# Altium project Jumperless_breadboard_REV1.PrjPcb (part 3 of 4)

## Sheet WS2812B_ARRAY.SchDoc
size 1524 x 1143 mm; SheetNumber: 8; SheetTotal: 14
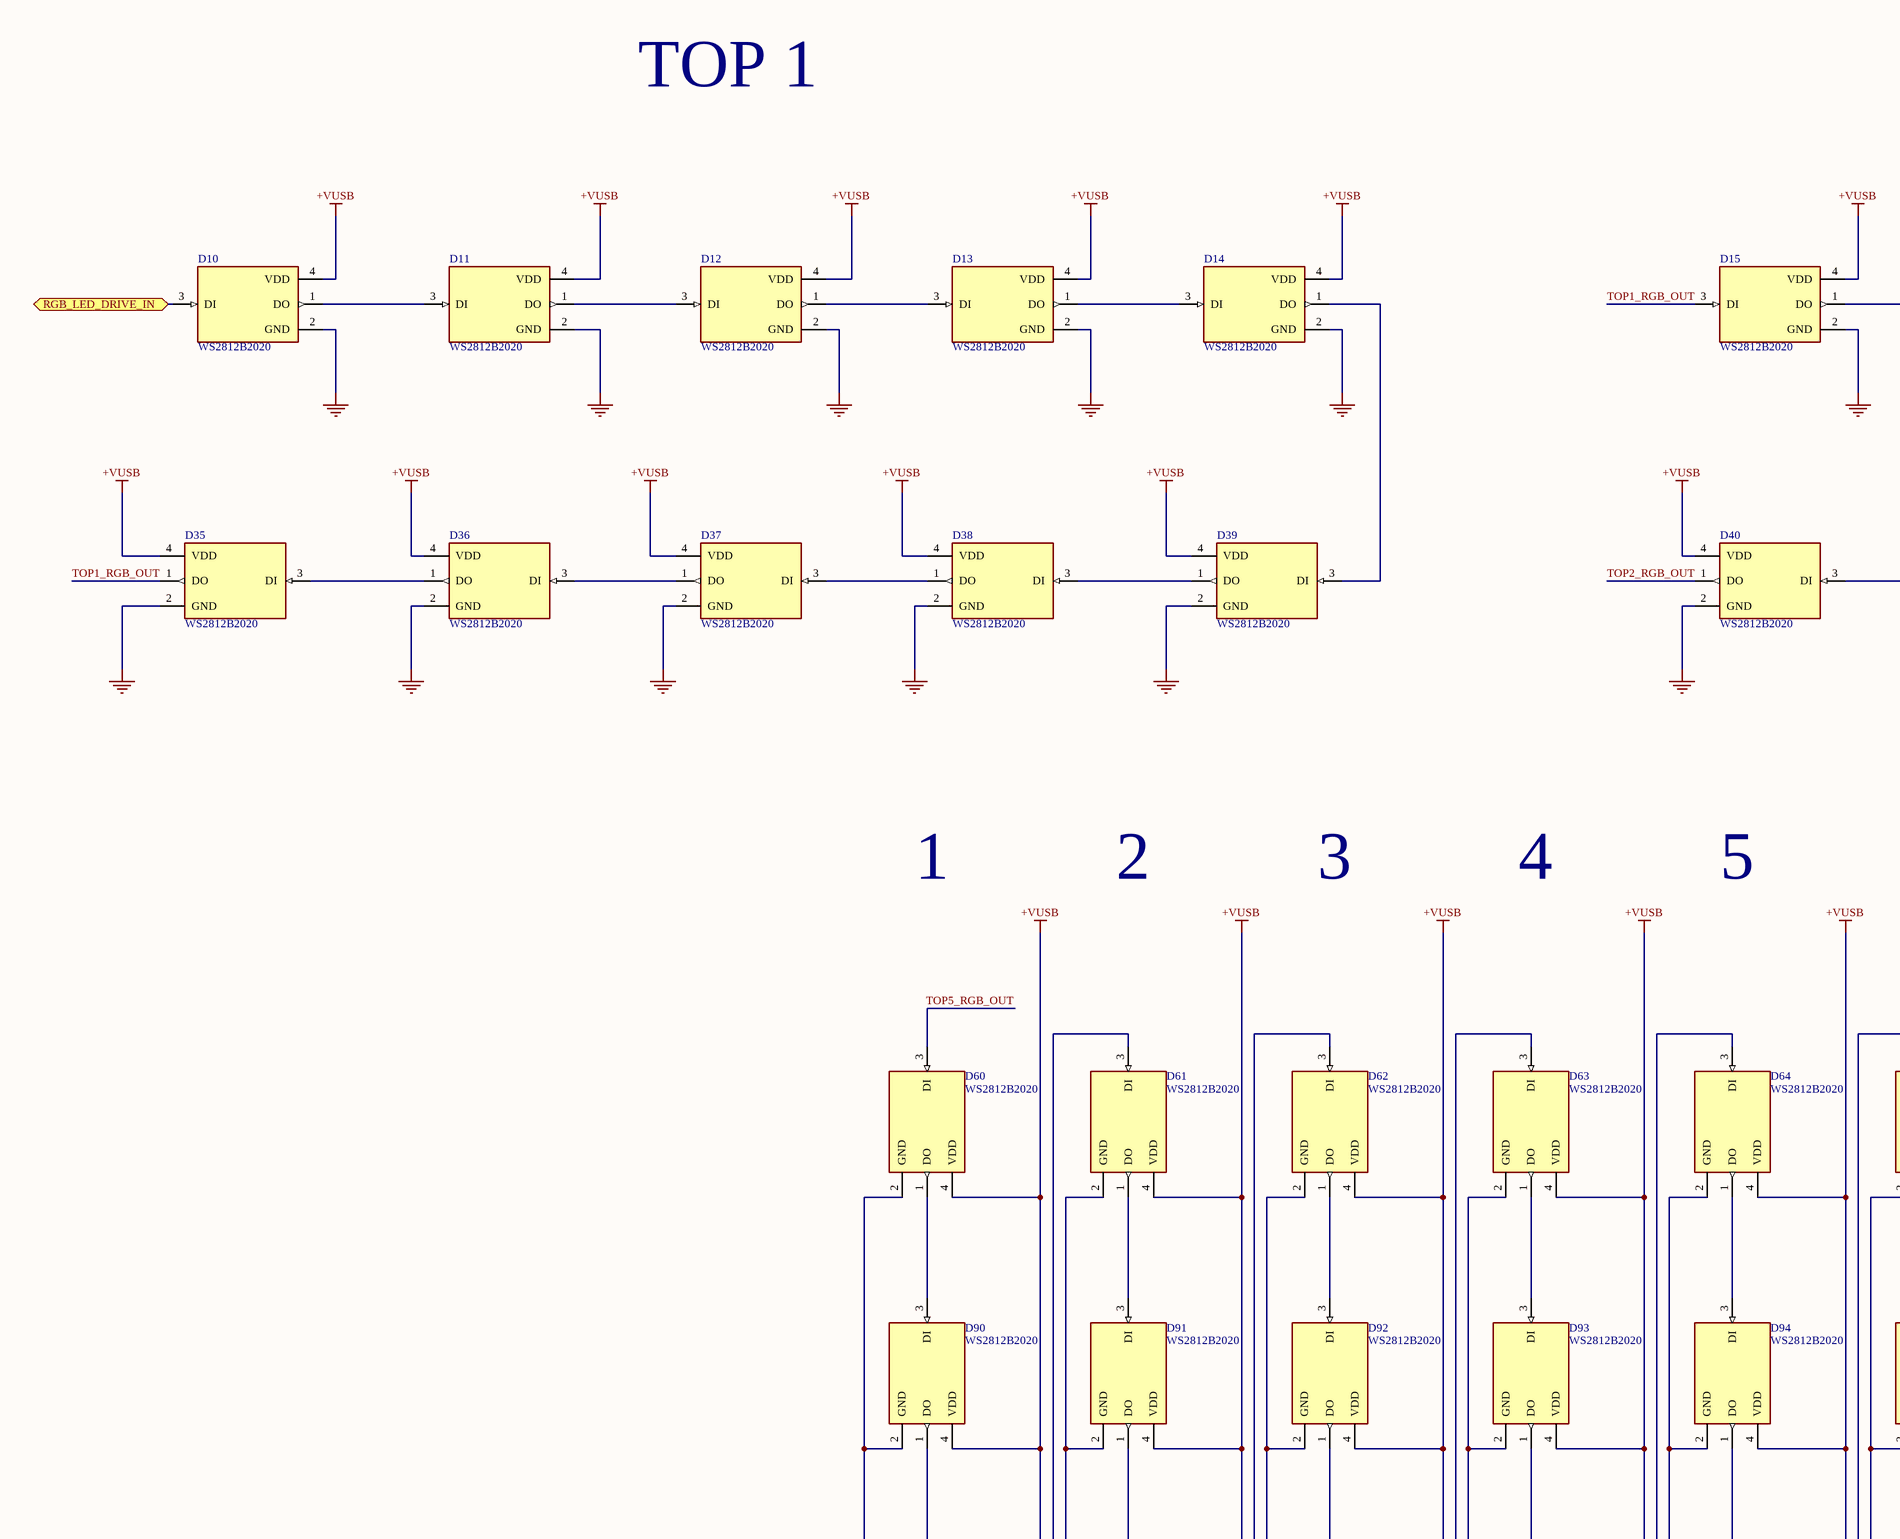
[diagram p16: WS2812B_ARRAY.SchDoc, top column 1 of 4]
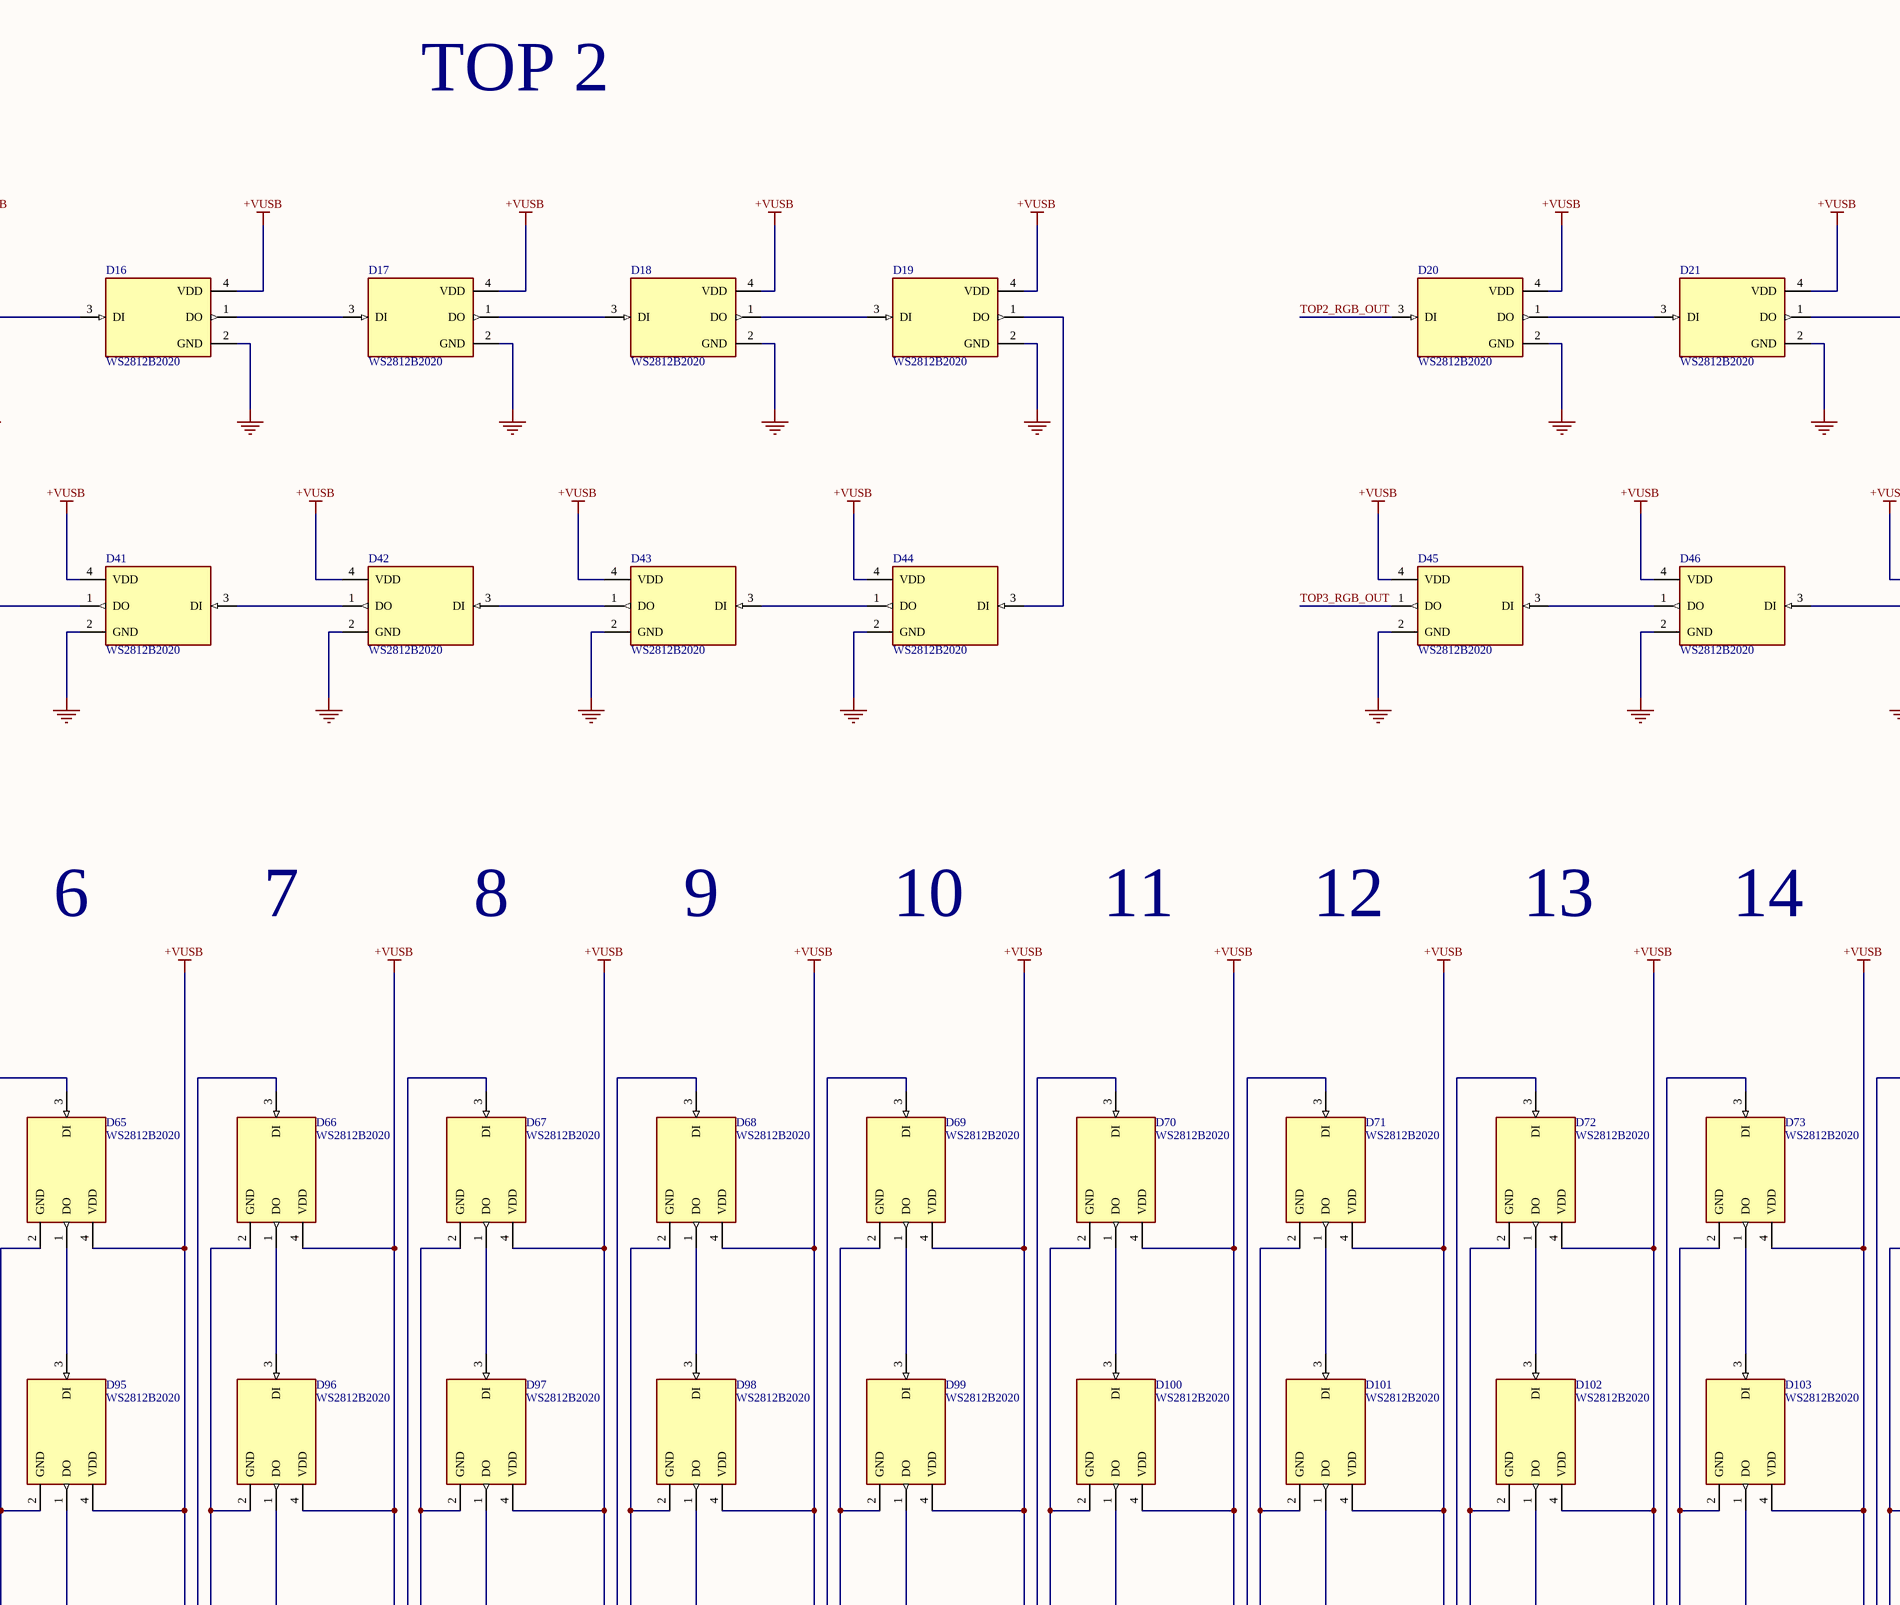
[diagram p17: WS2812B_ARRAY.SchDoc, top column 2 of 4]
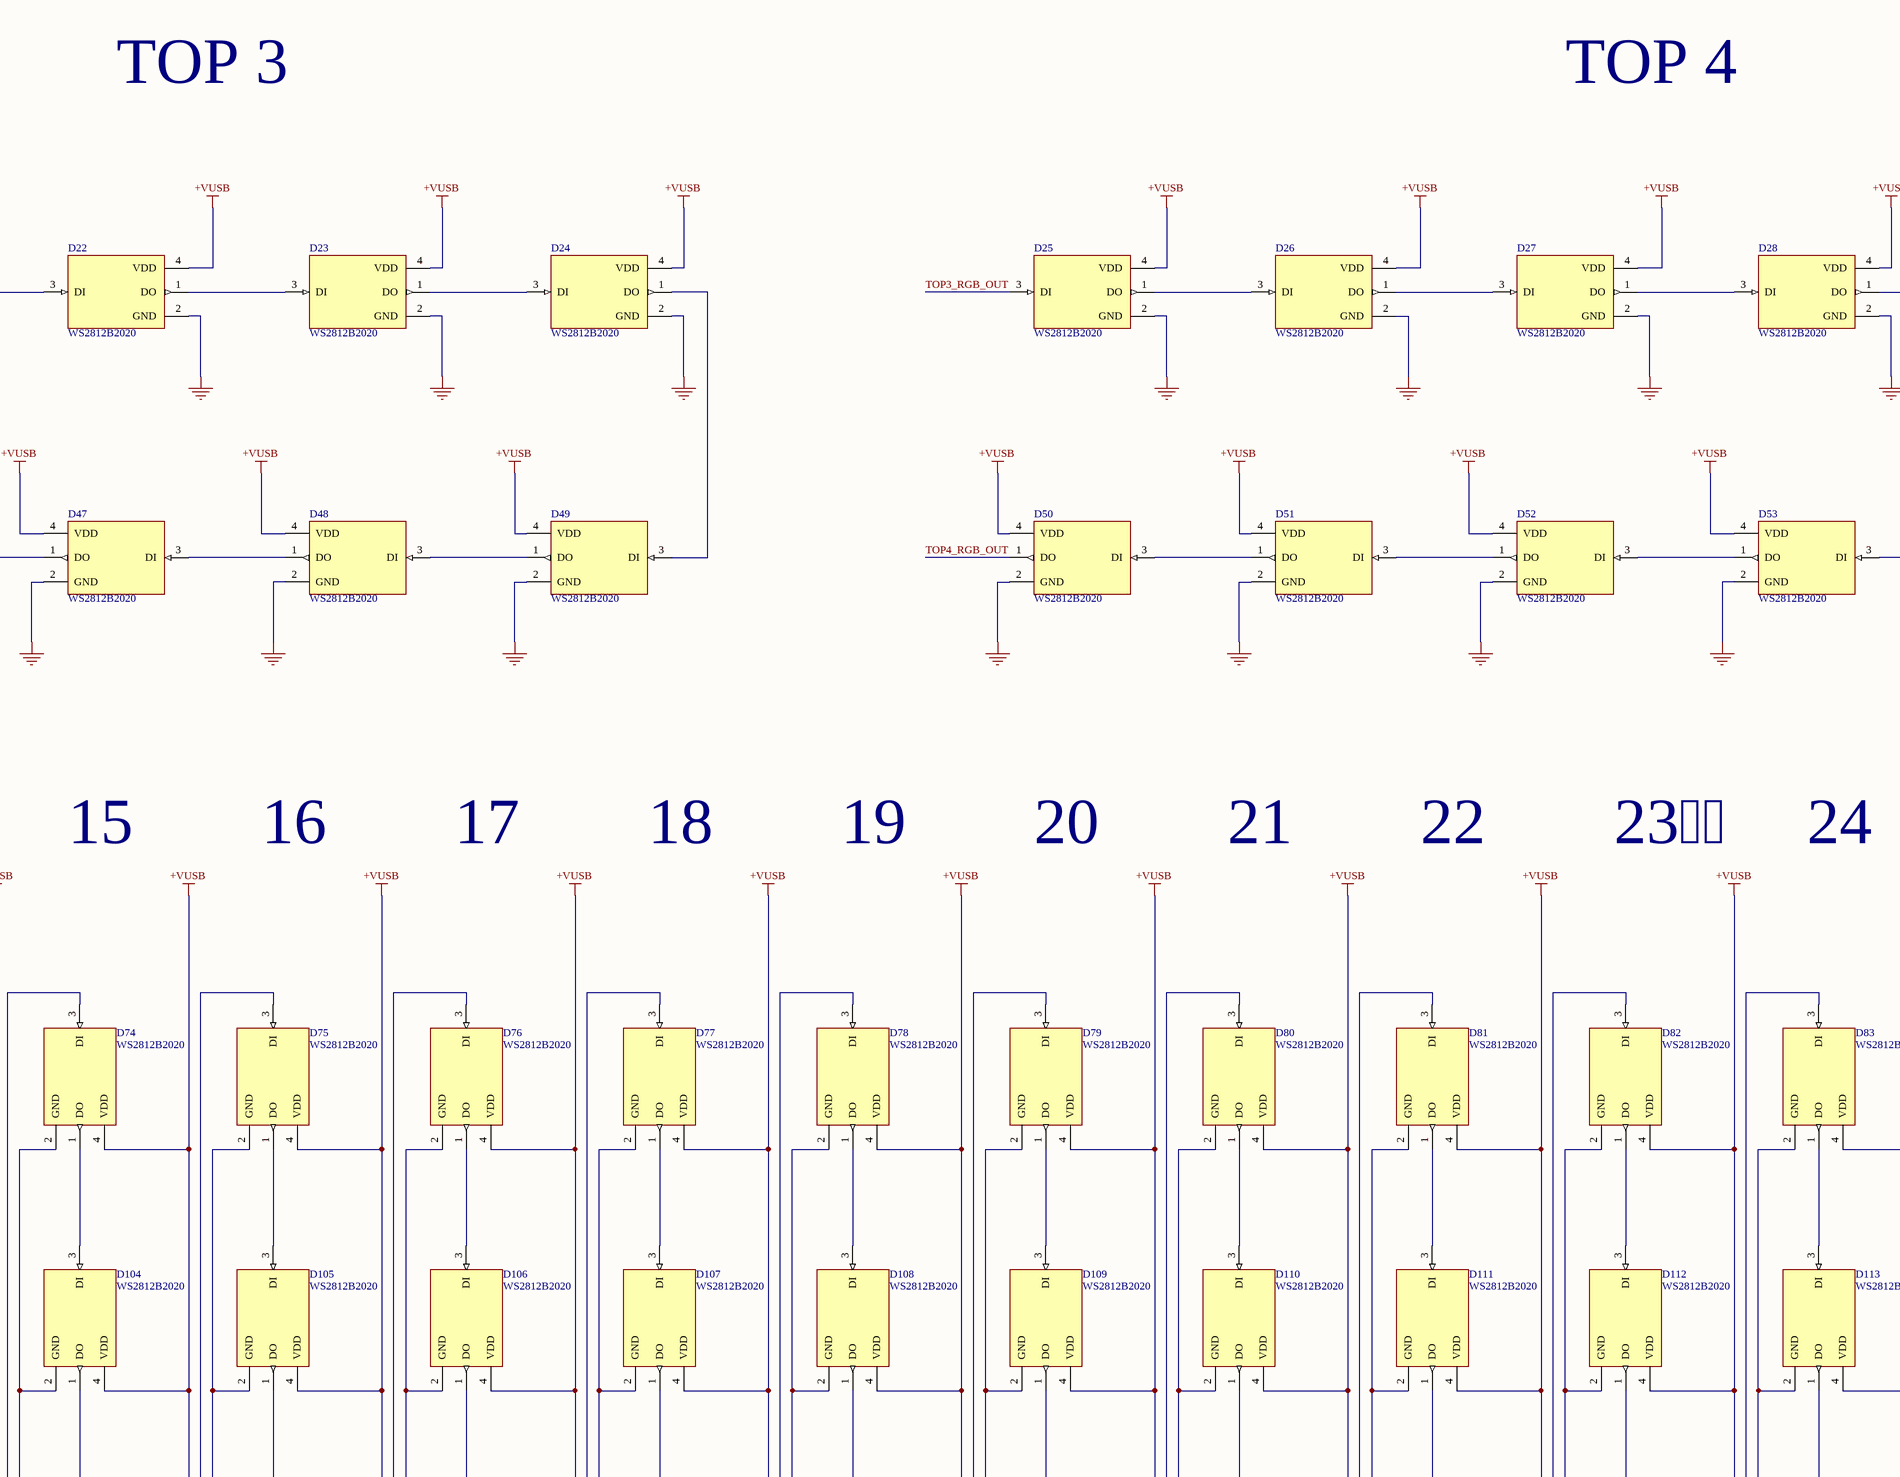
[diagram p18: WS2812B_ARRAY.SchDoc, top column 3 of 4]
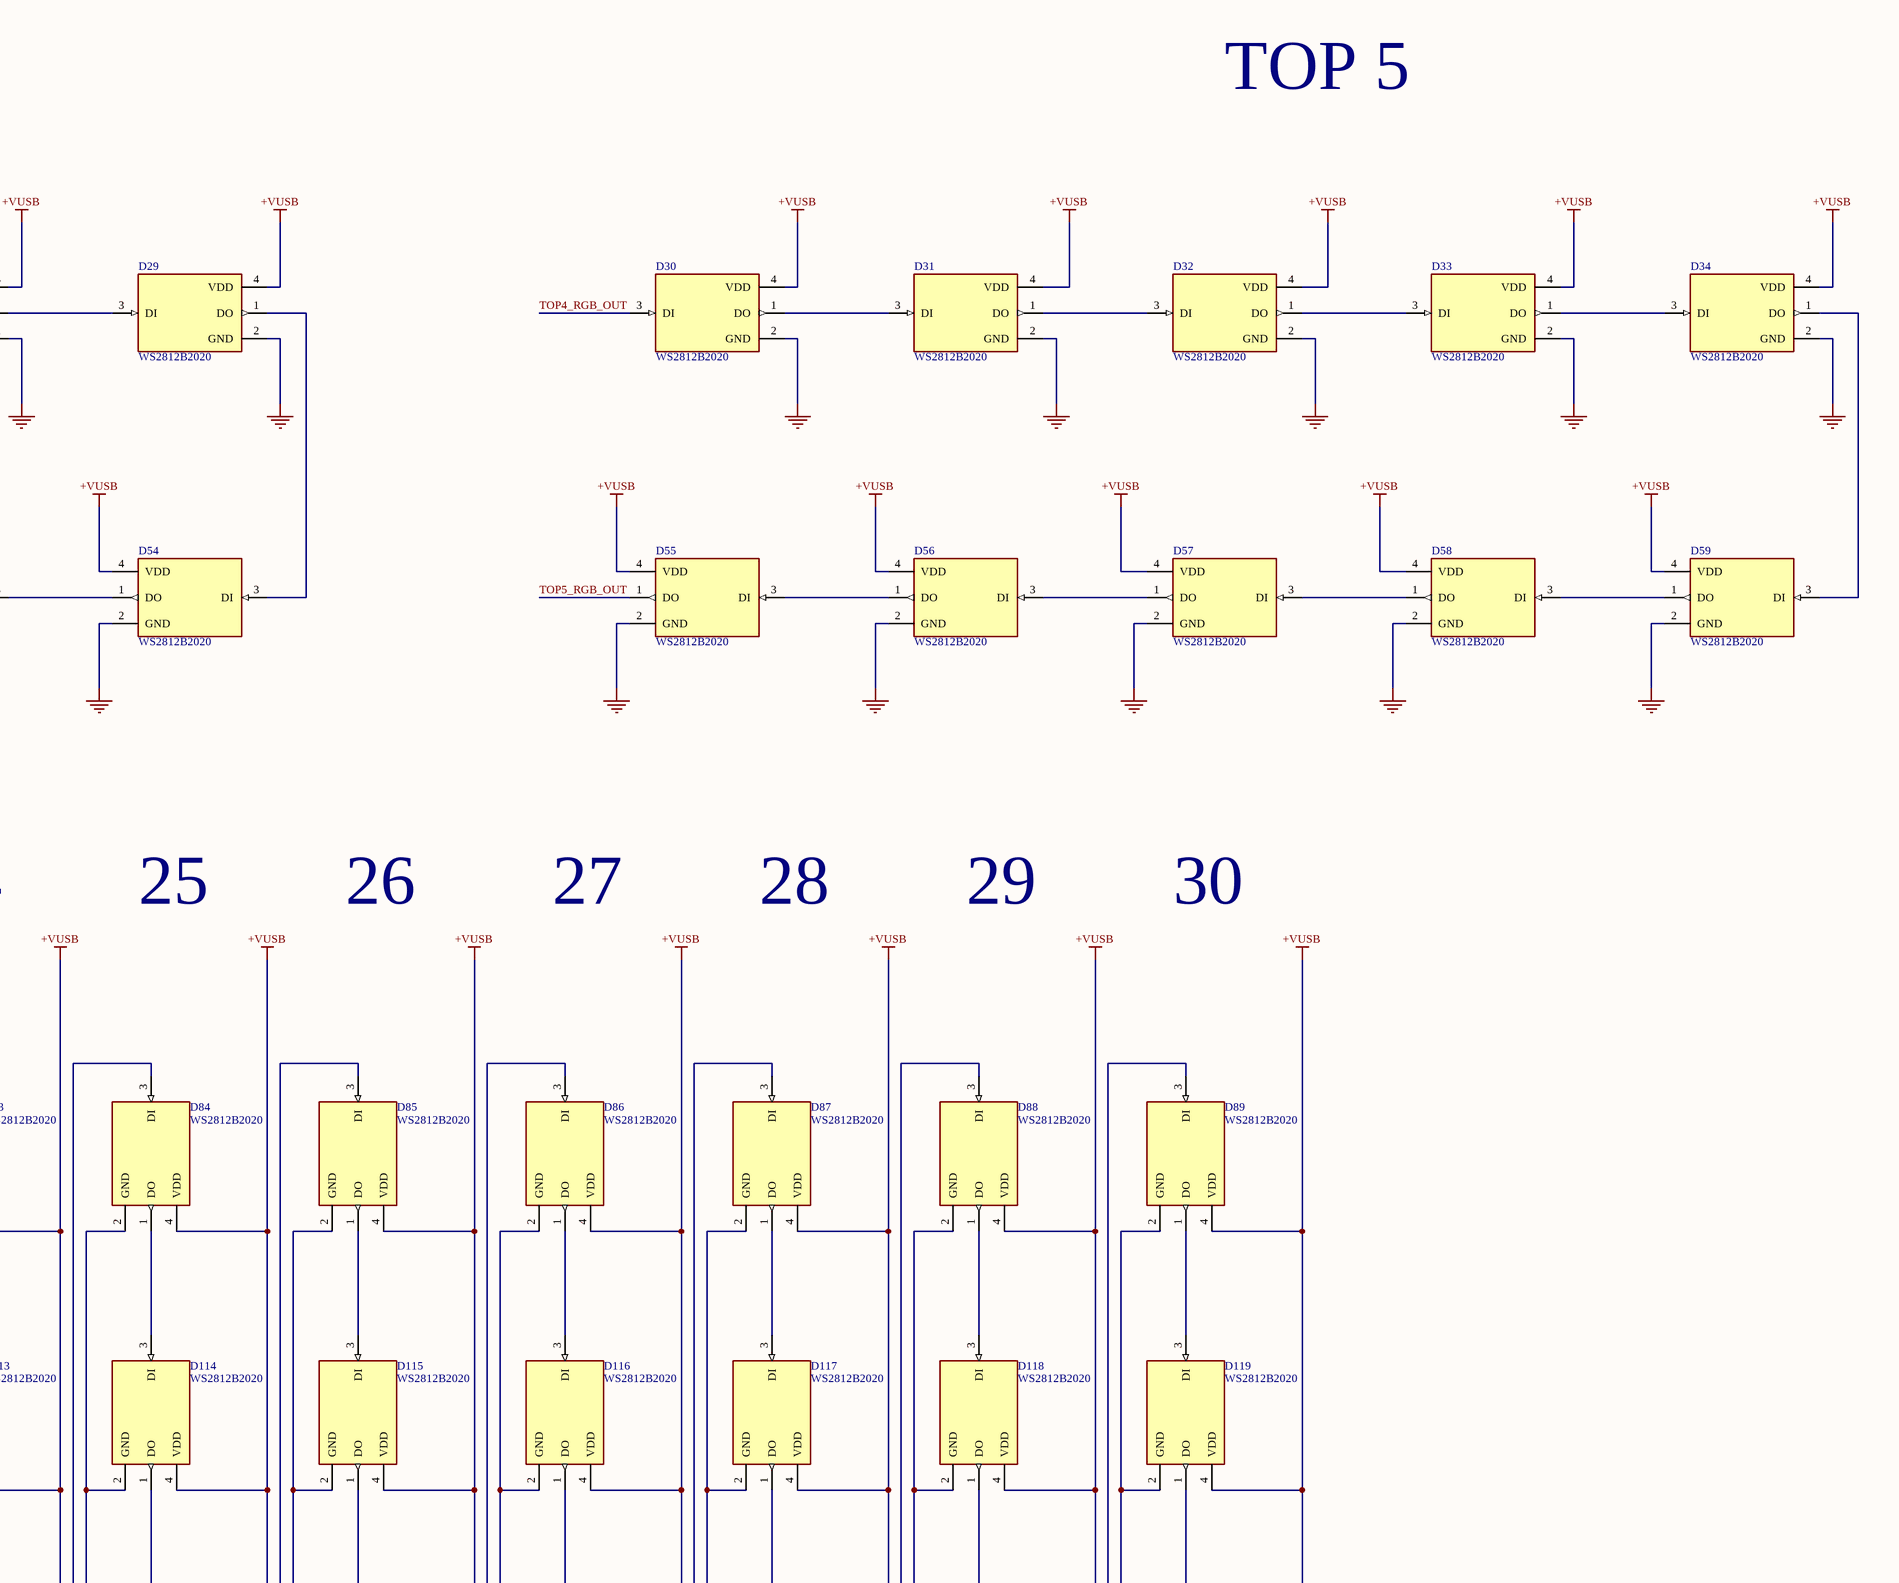
[diagram p19: WS2812B_ARRAY.SchDoc, top column 4 of 4]
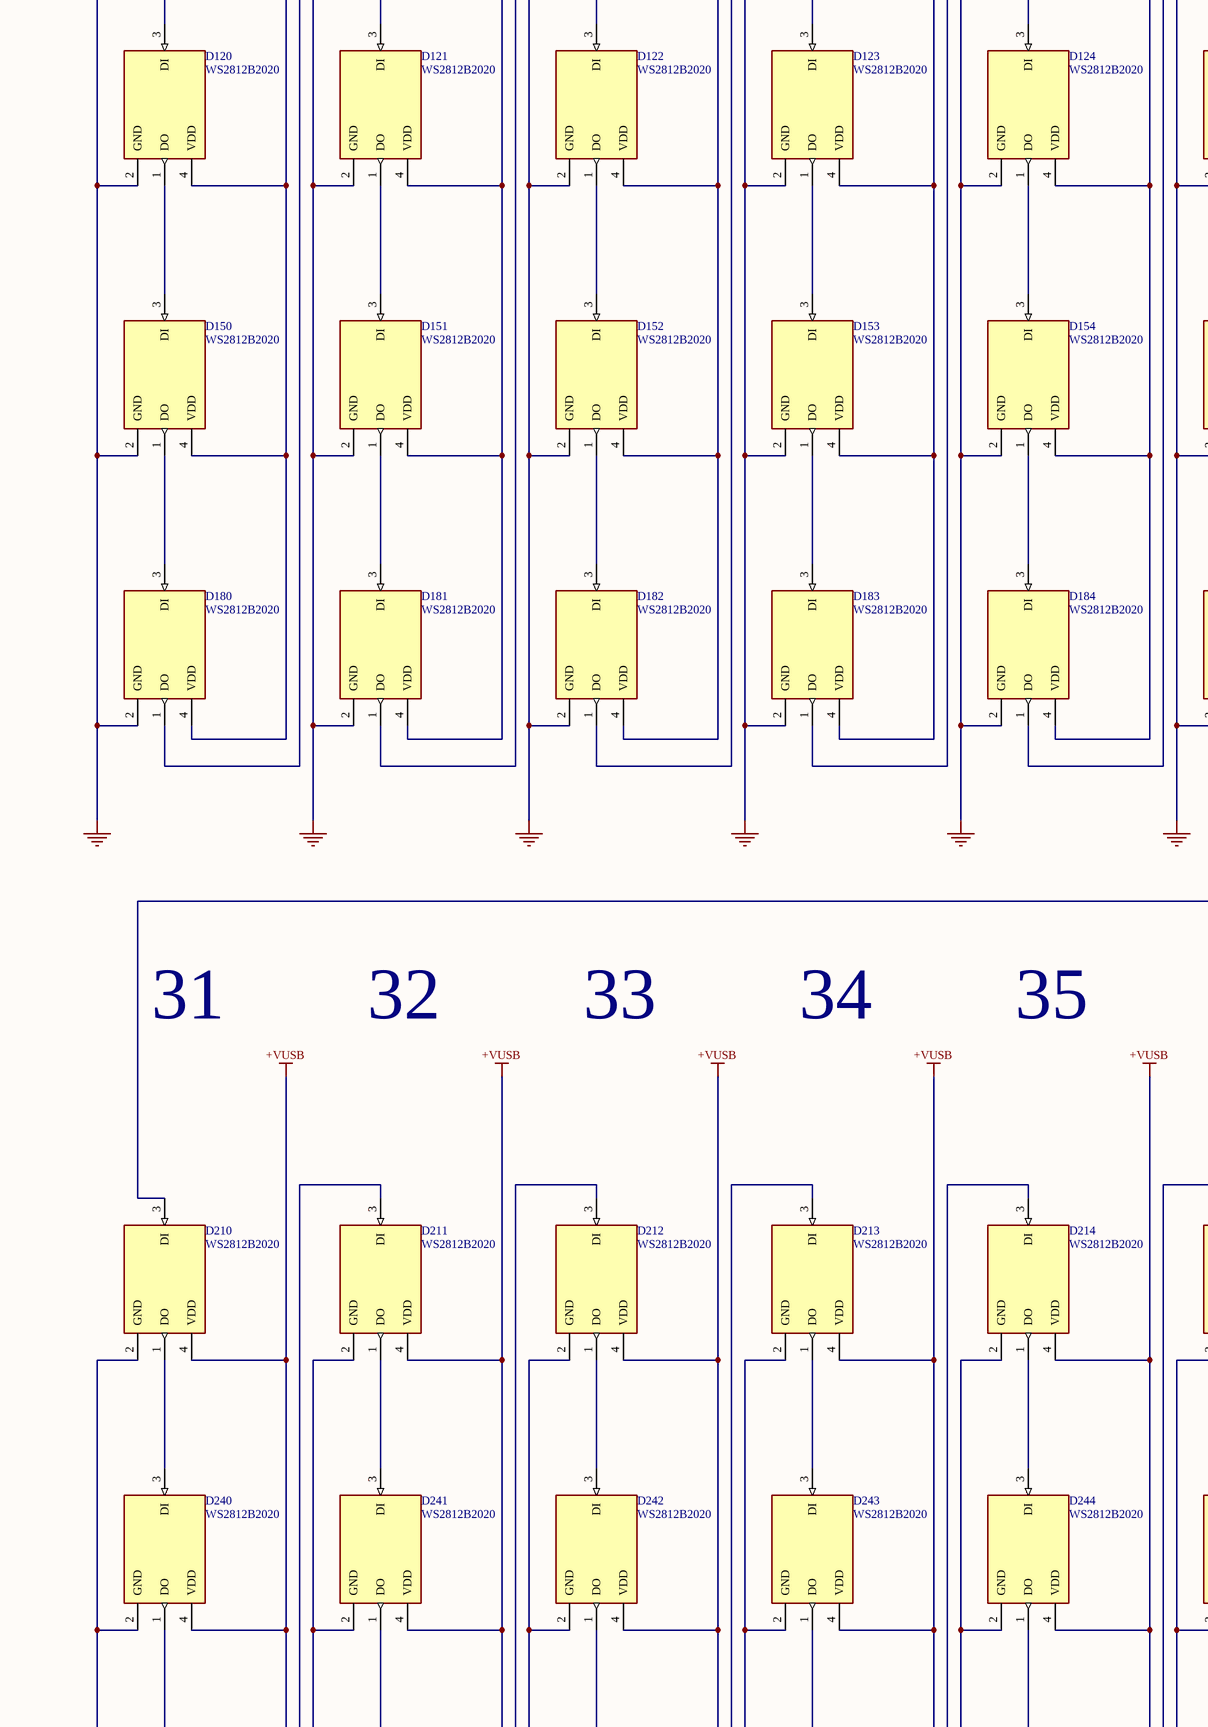
[diagram p20: WS2812B_ARRAY.SchDoc, centre column 1 of 4]
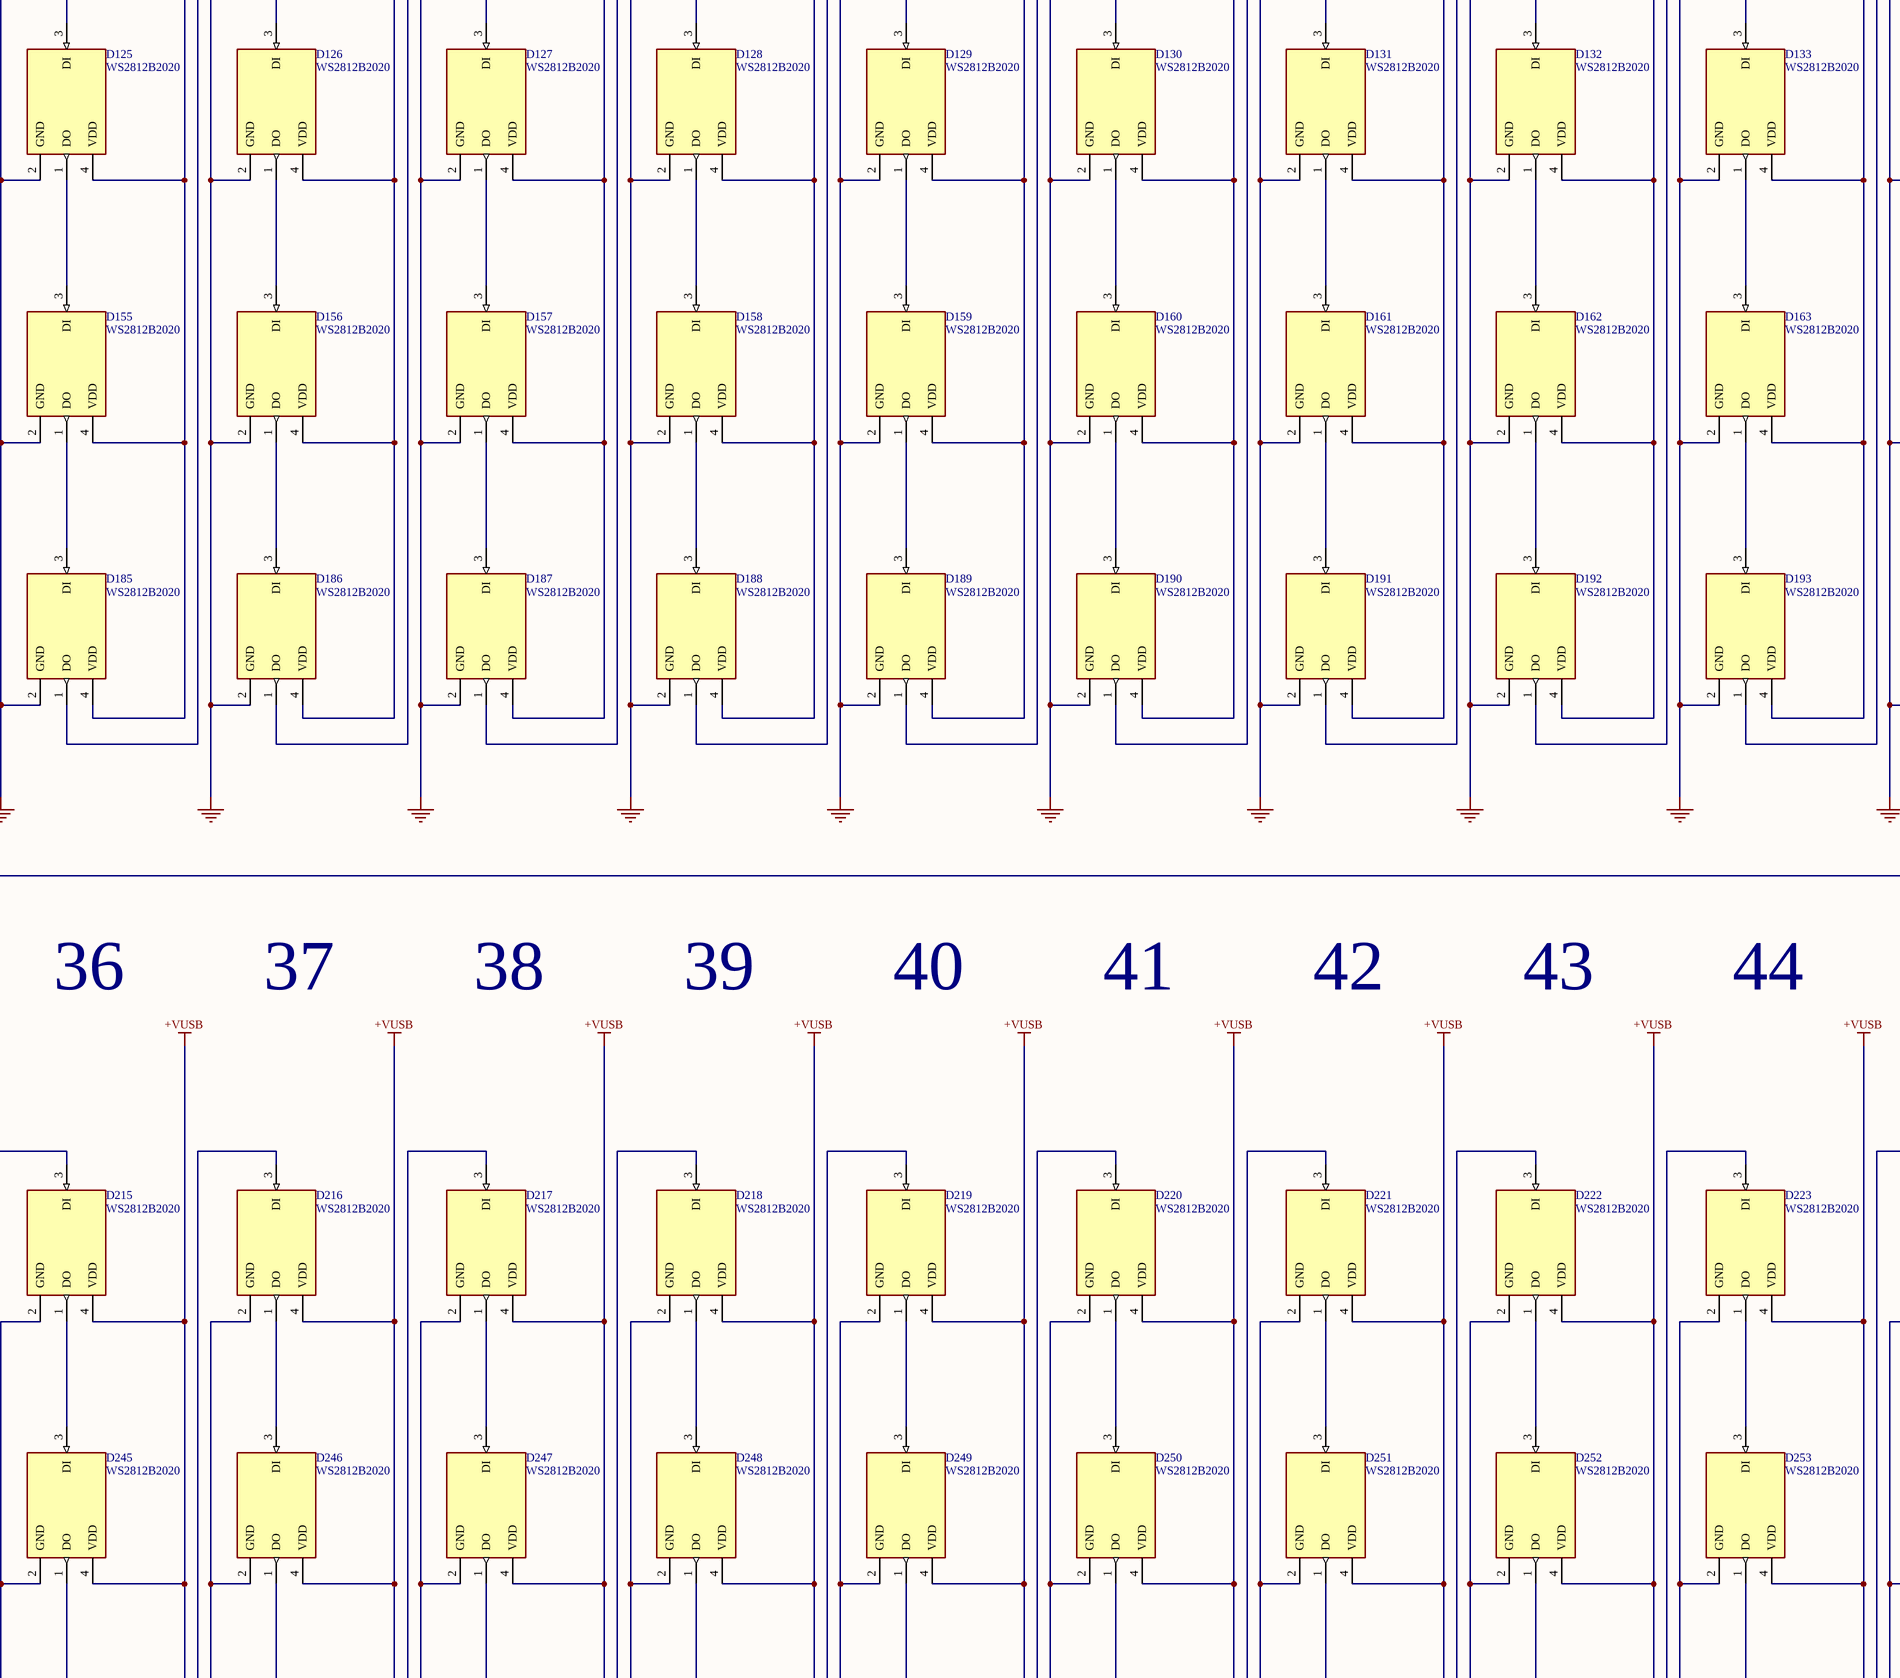
[diagram p21: WS2812B_ARRAY.SchDoc, centre column 2 of 4]
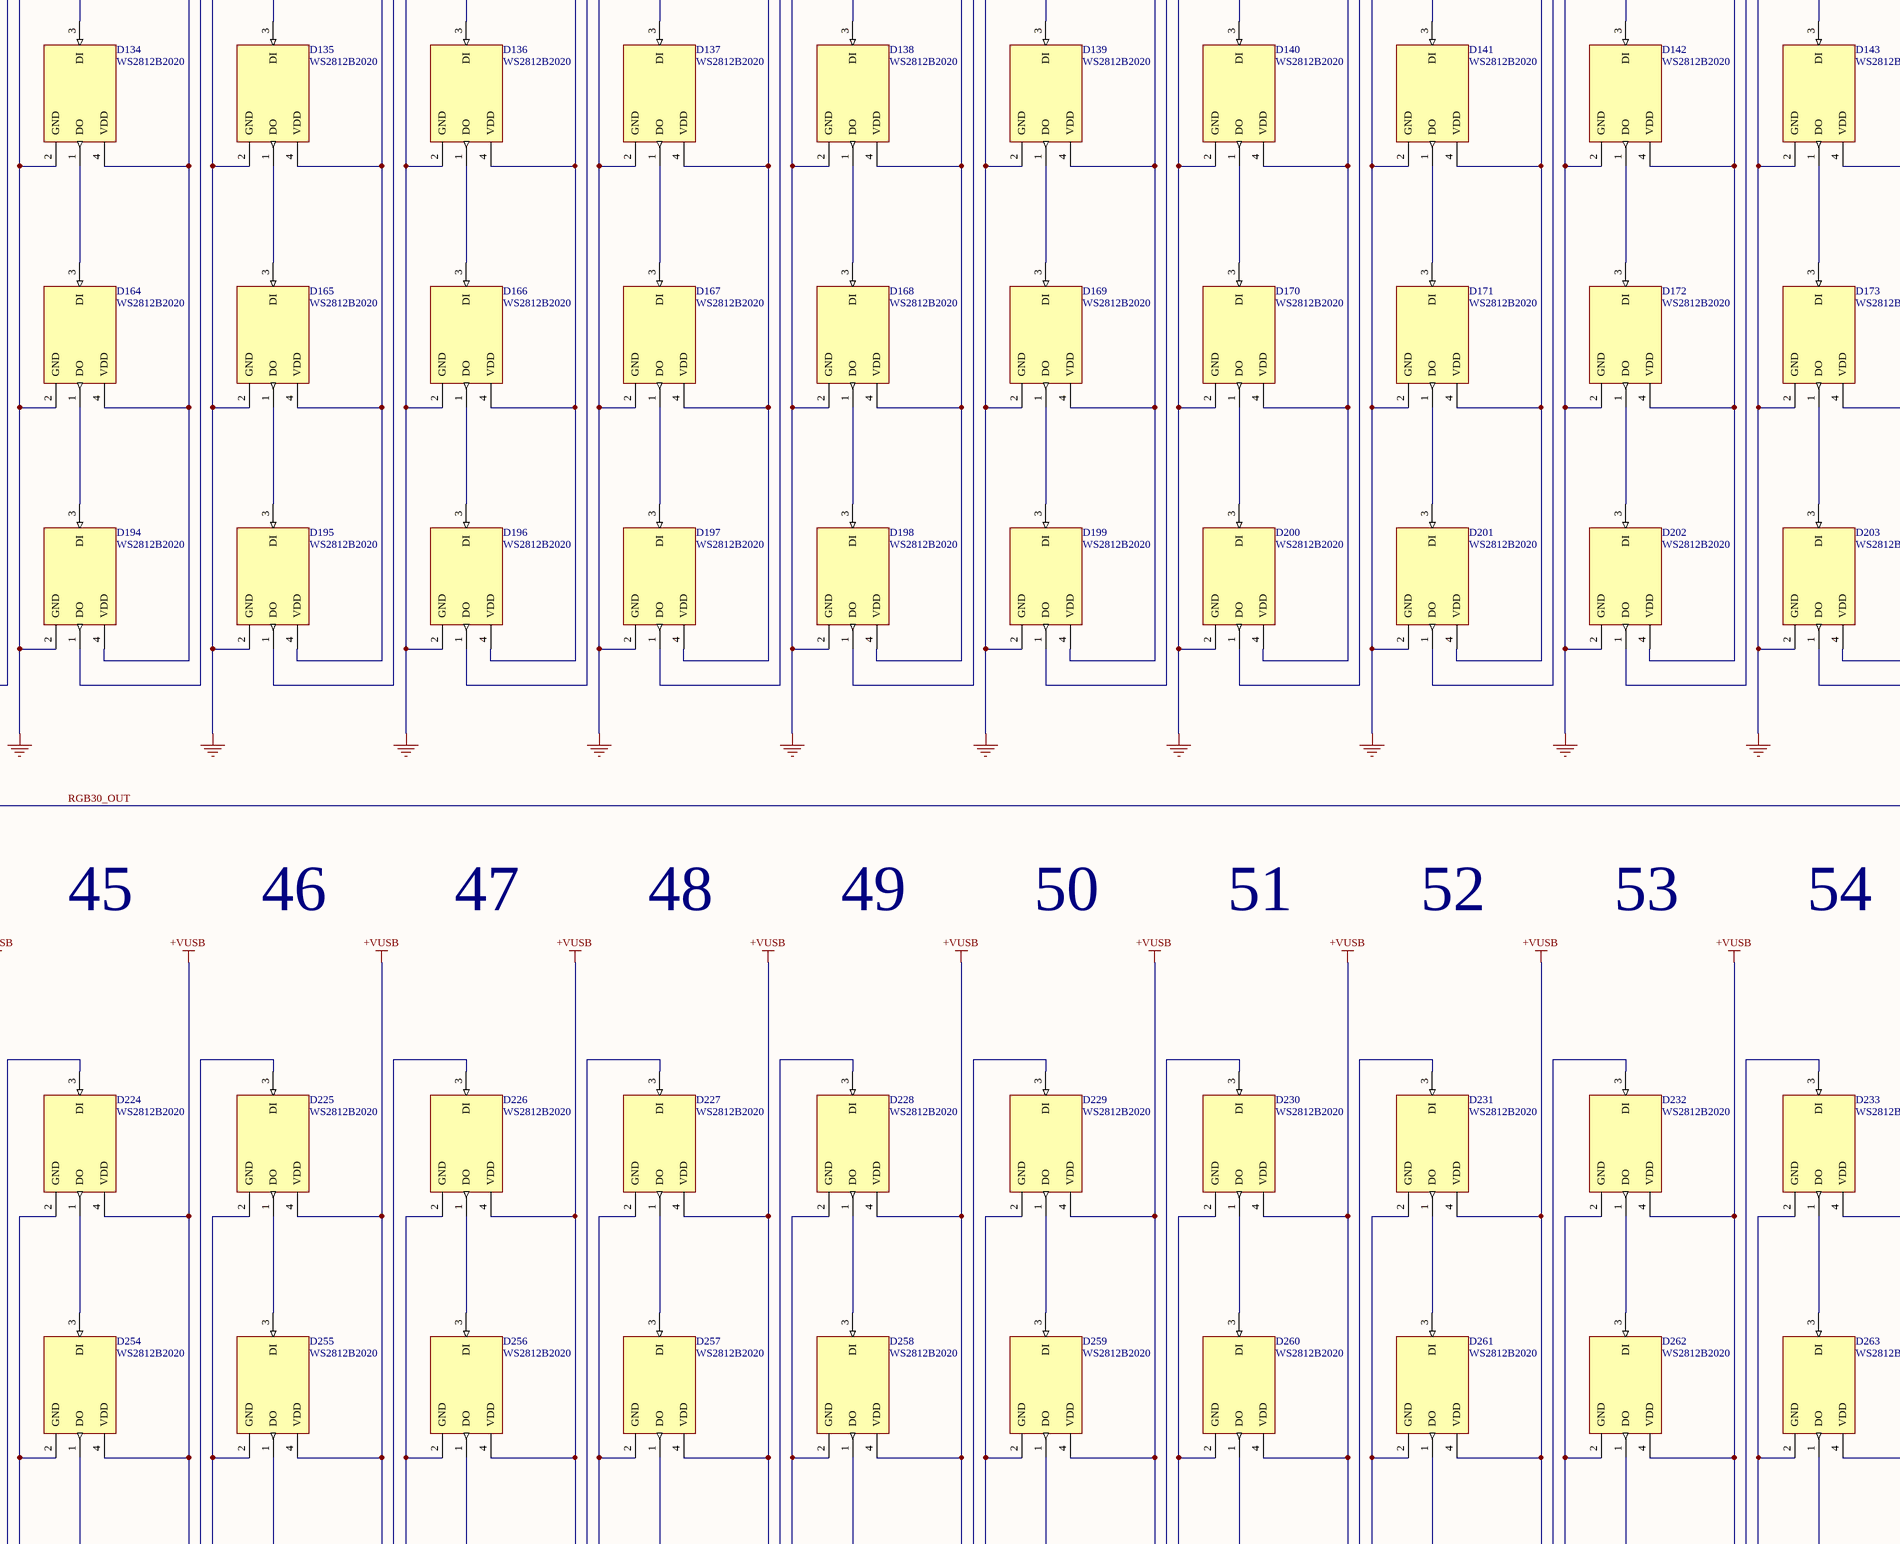
[diagram p22: WS2812B_ARRAY.SchDoc, centre column 3 of 4]
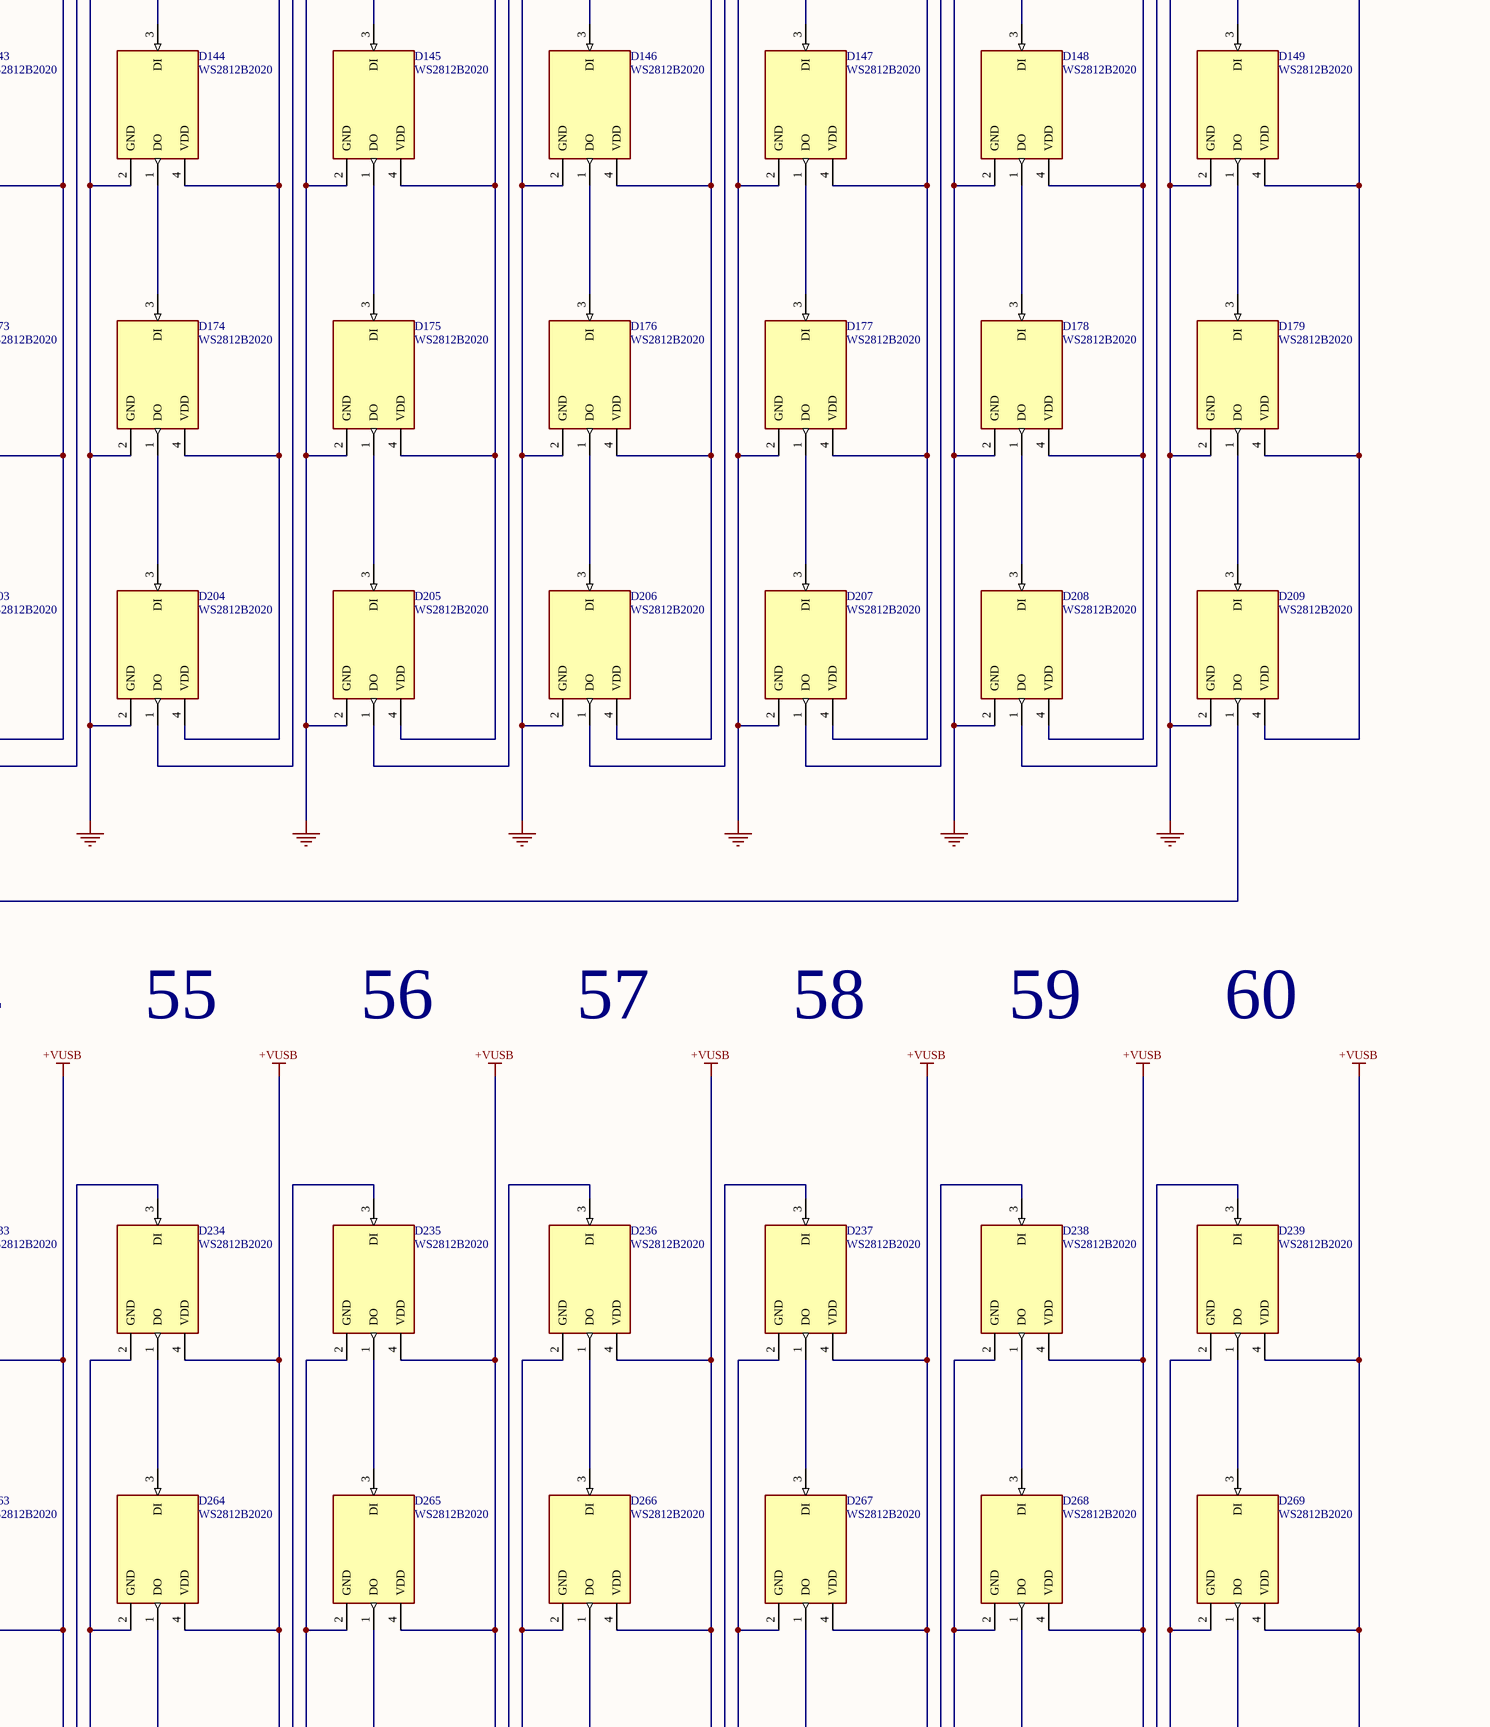
[diagram p23: WS2812B_ARRAY.SchDoc, centre column 4 of 4]
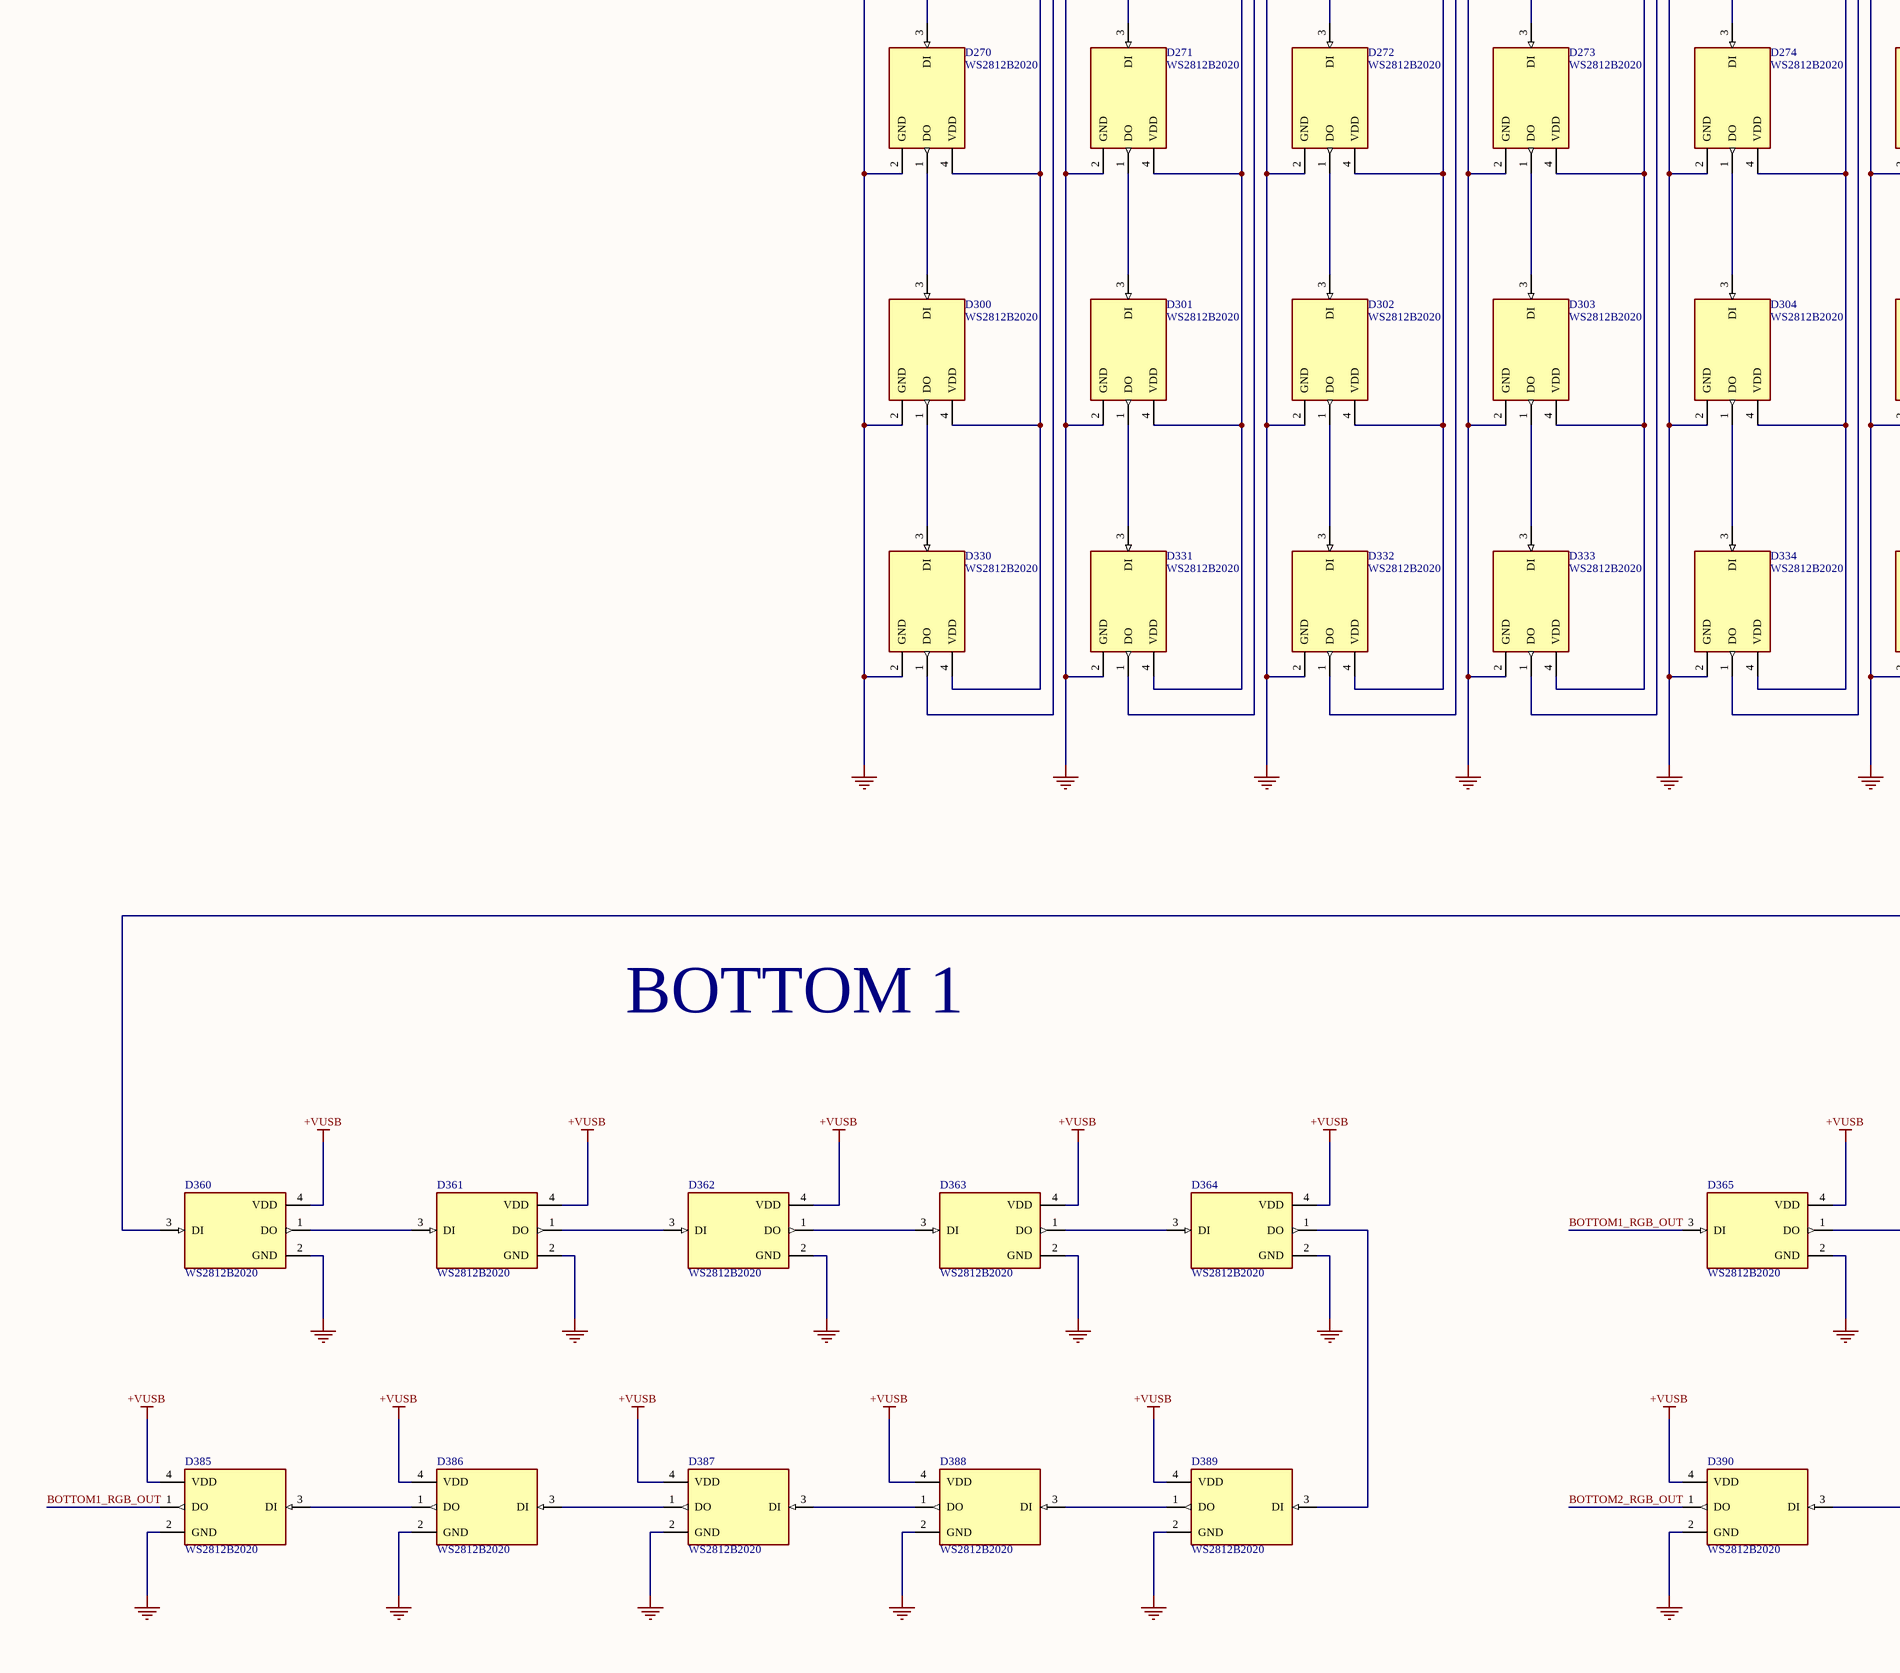
[diagram p24: WS2812B_ARRAY.SchDoc, bottom column 1 of 4]
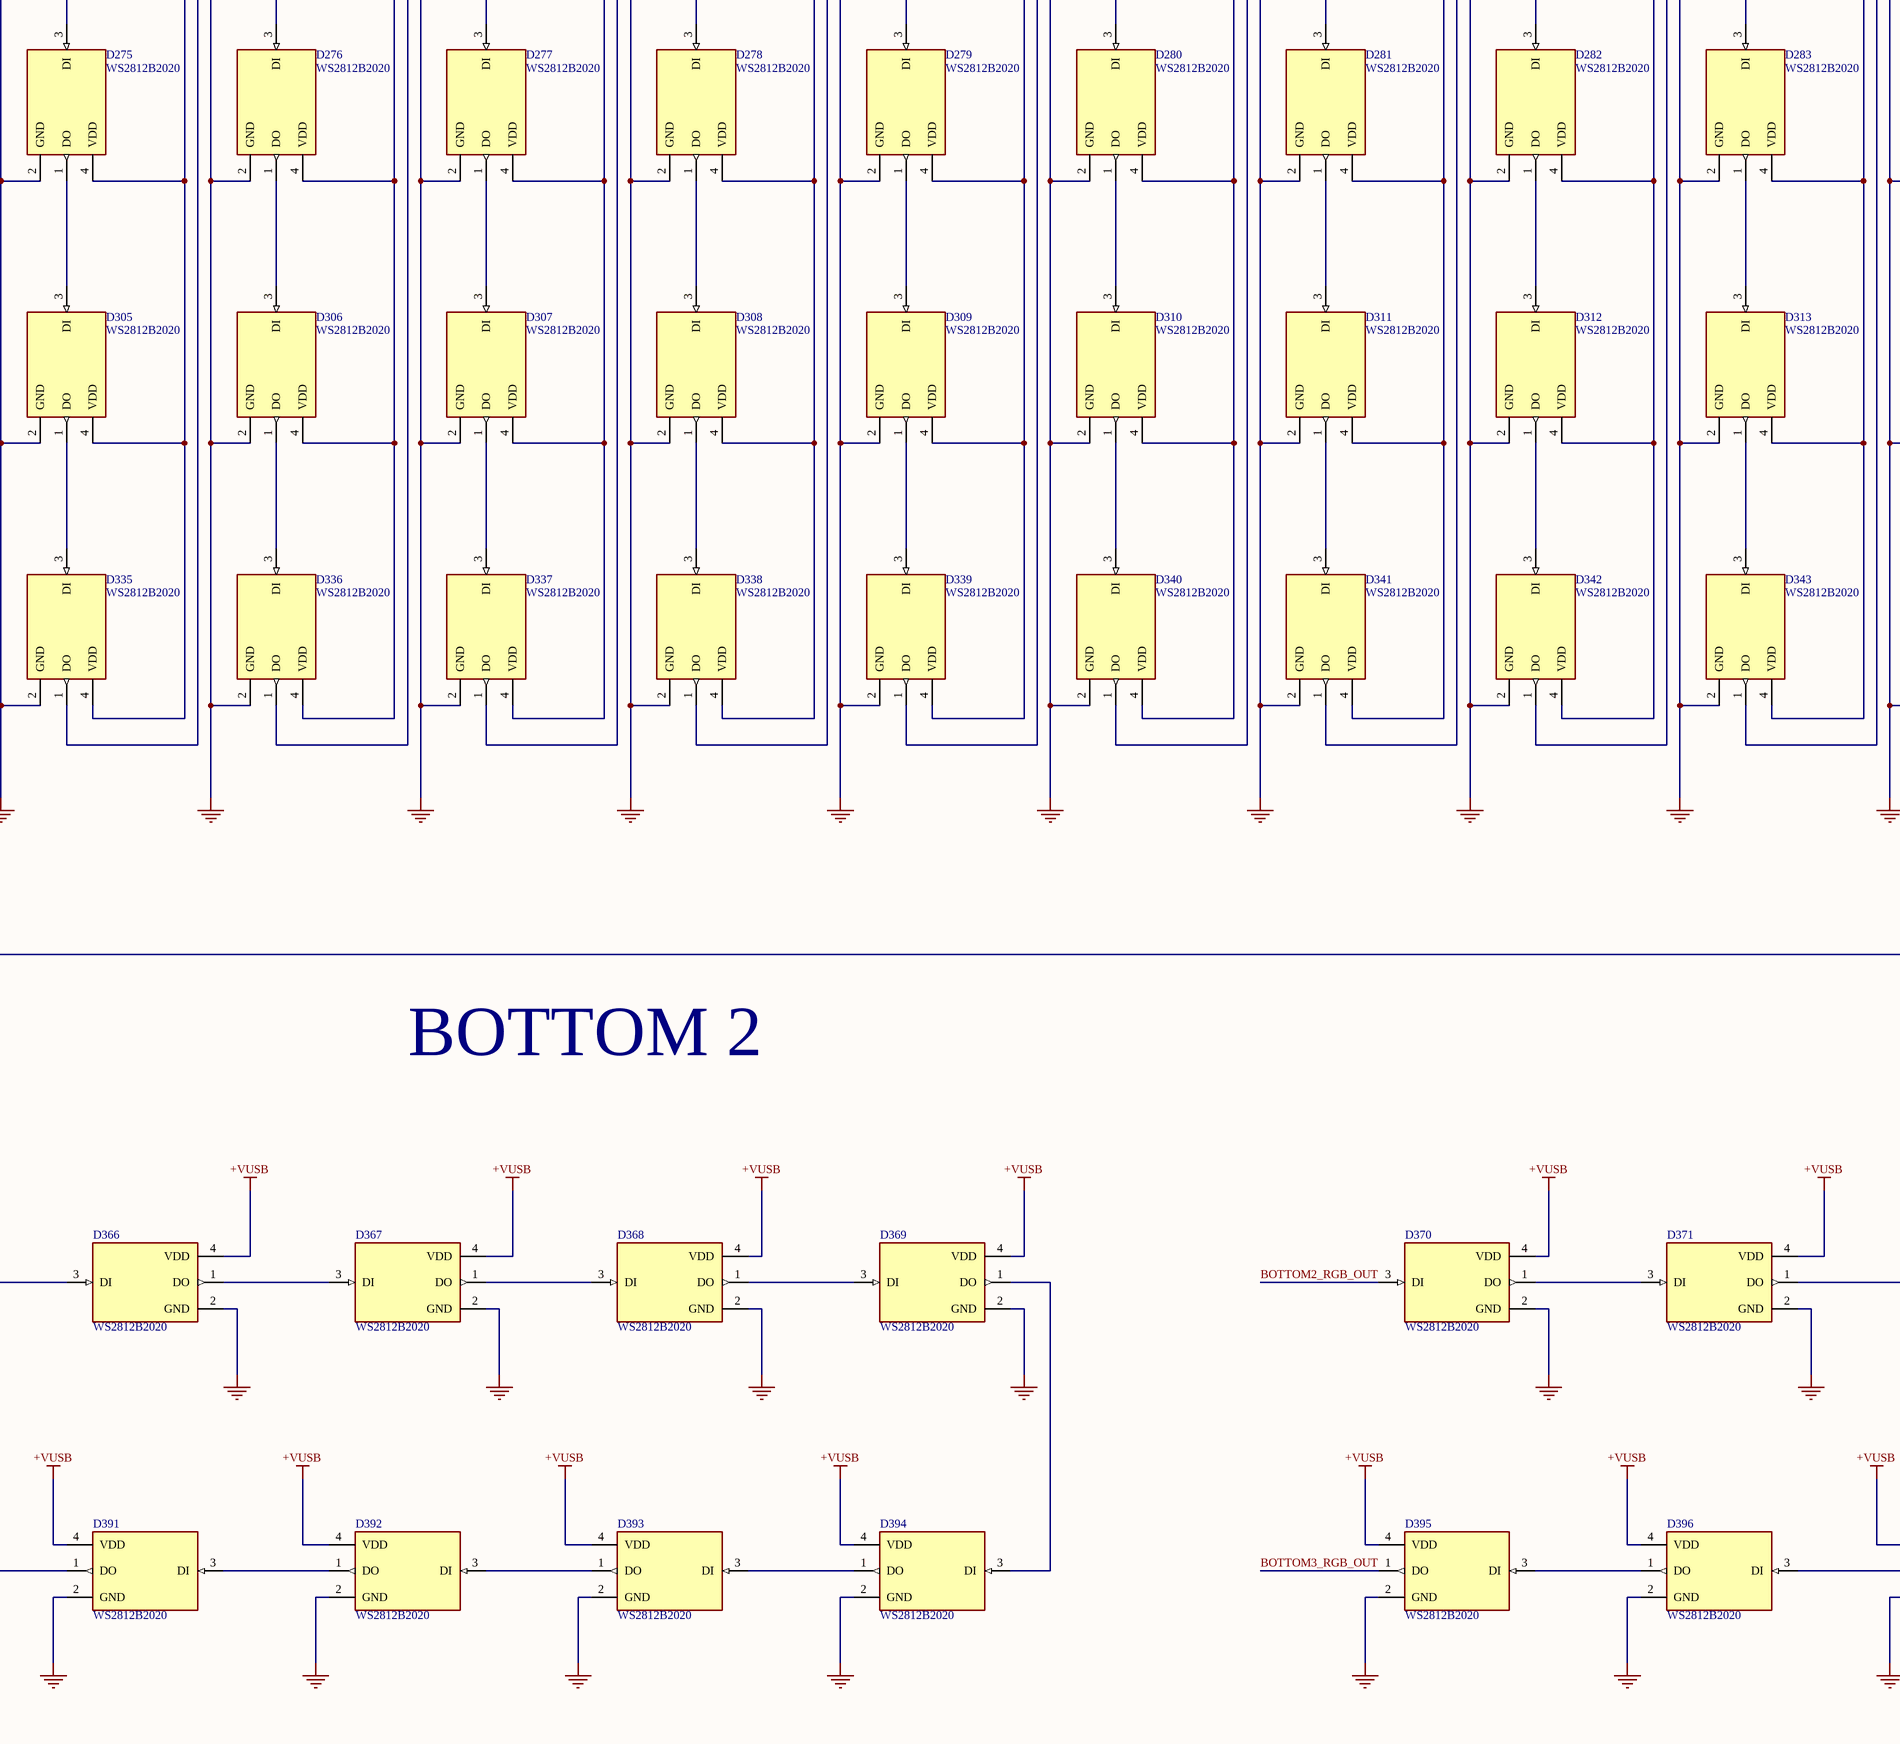
[diagram p25: WS2812B_ARRAY.SchDoc, bottom column 2 of 4]
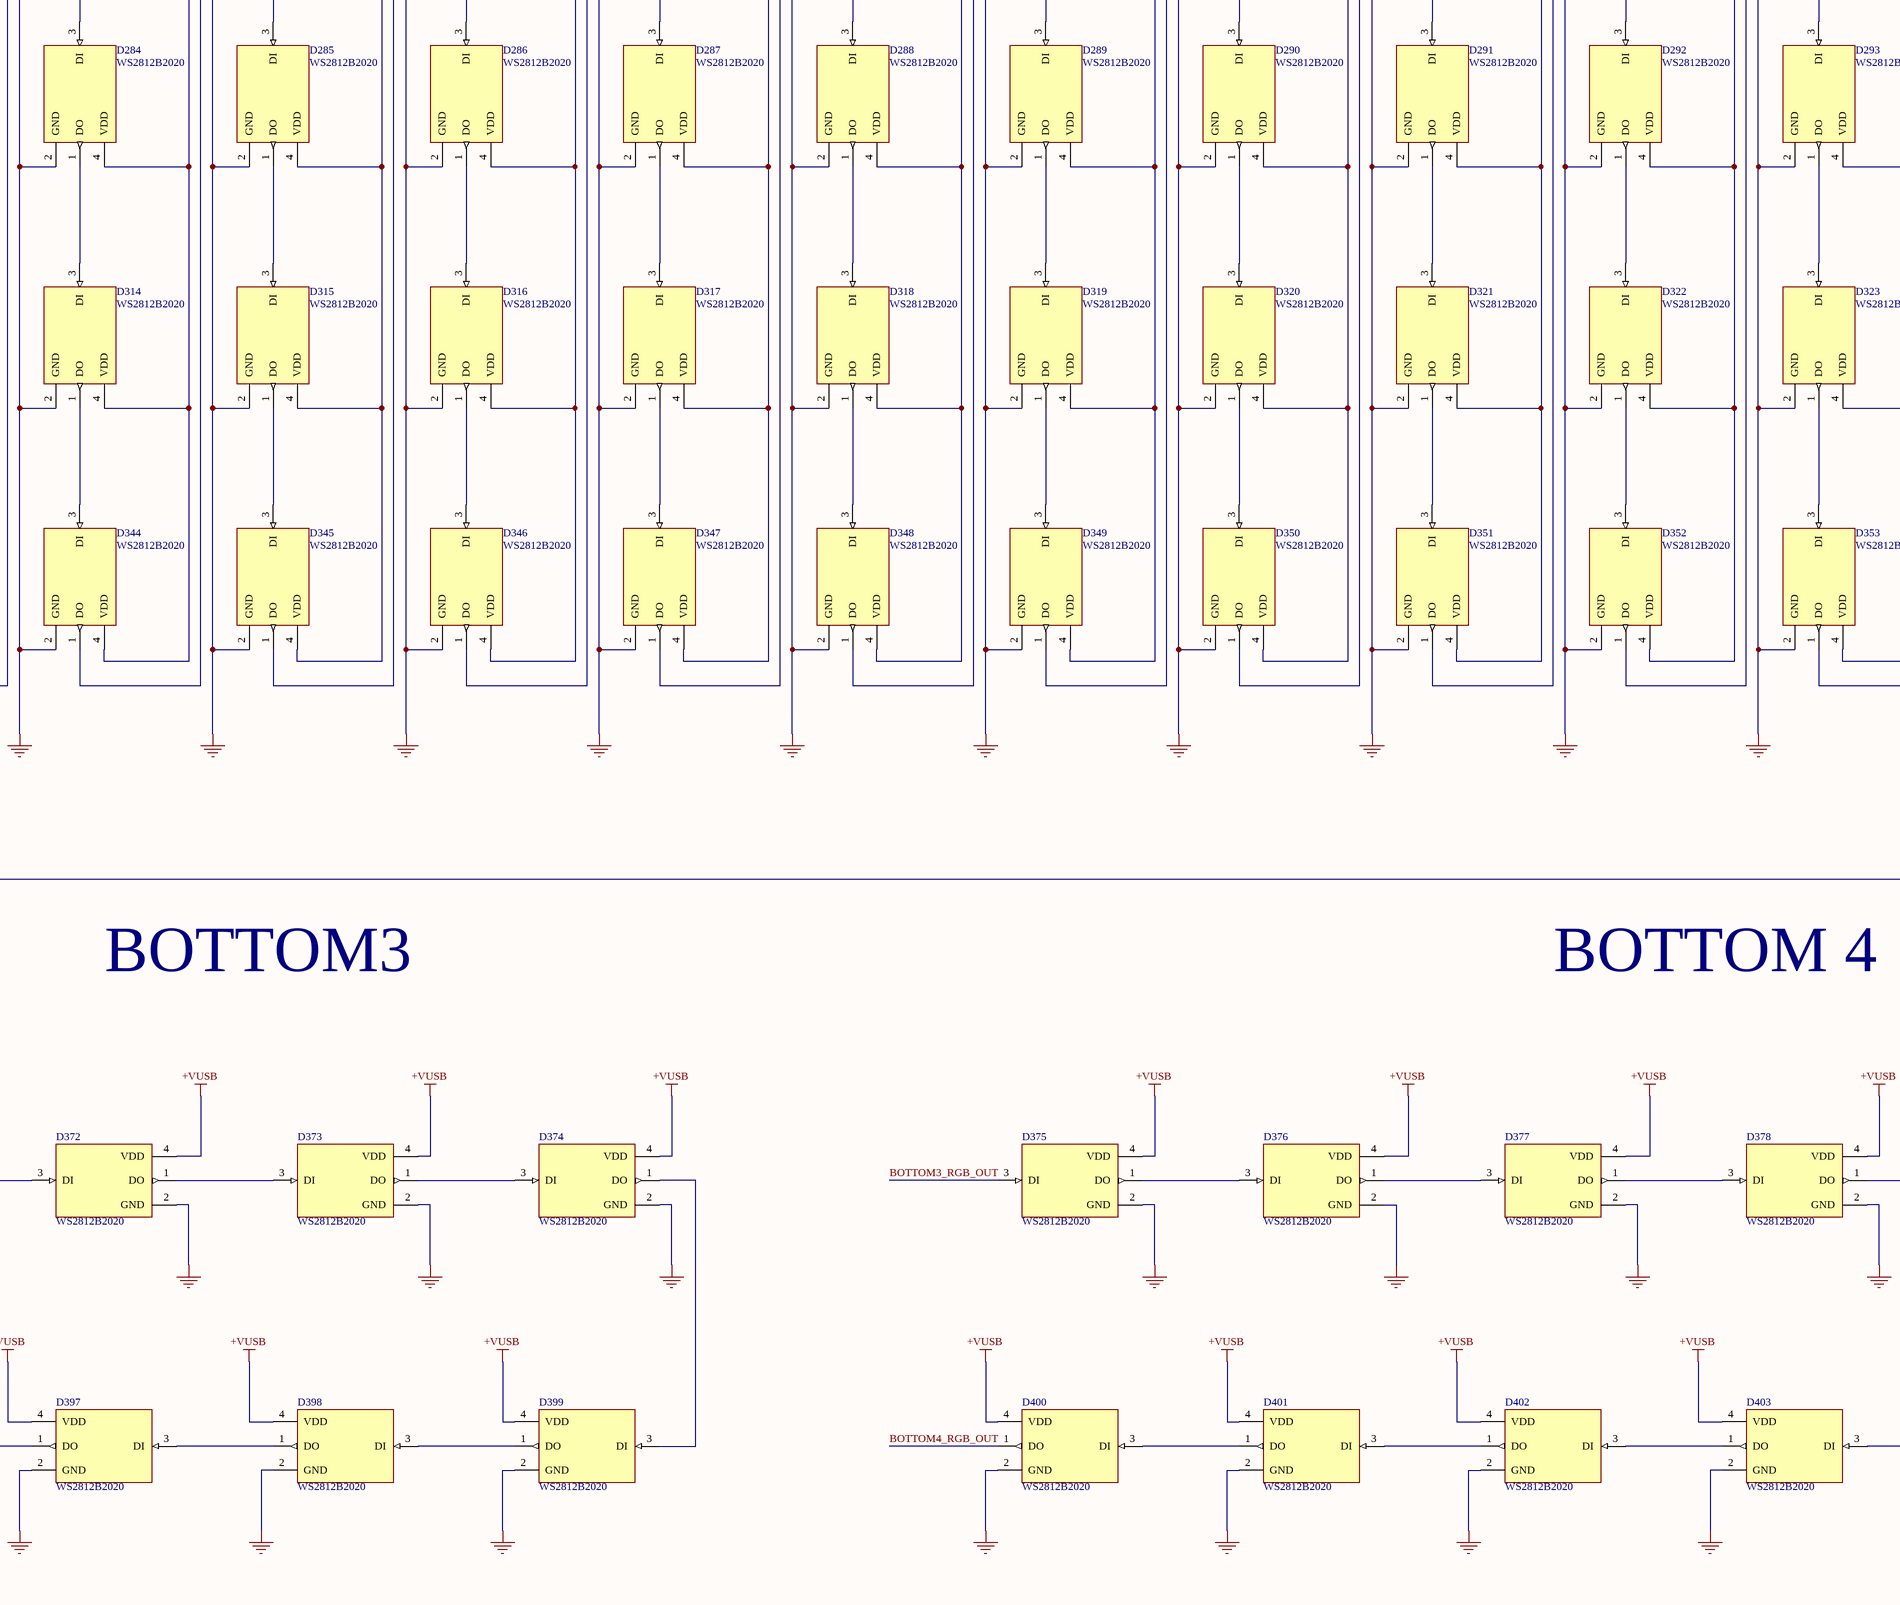
[diagram p26: WS2812B_ARRAY.SchDoc, bottom column 3 of 4]
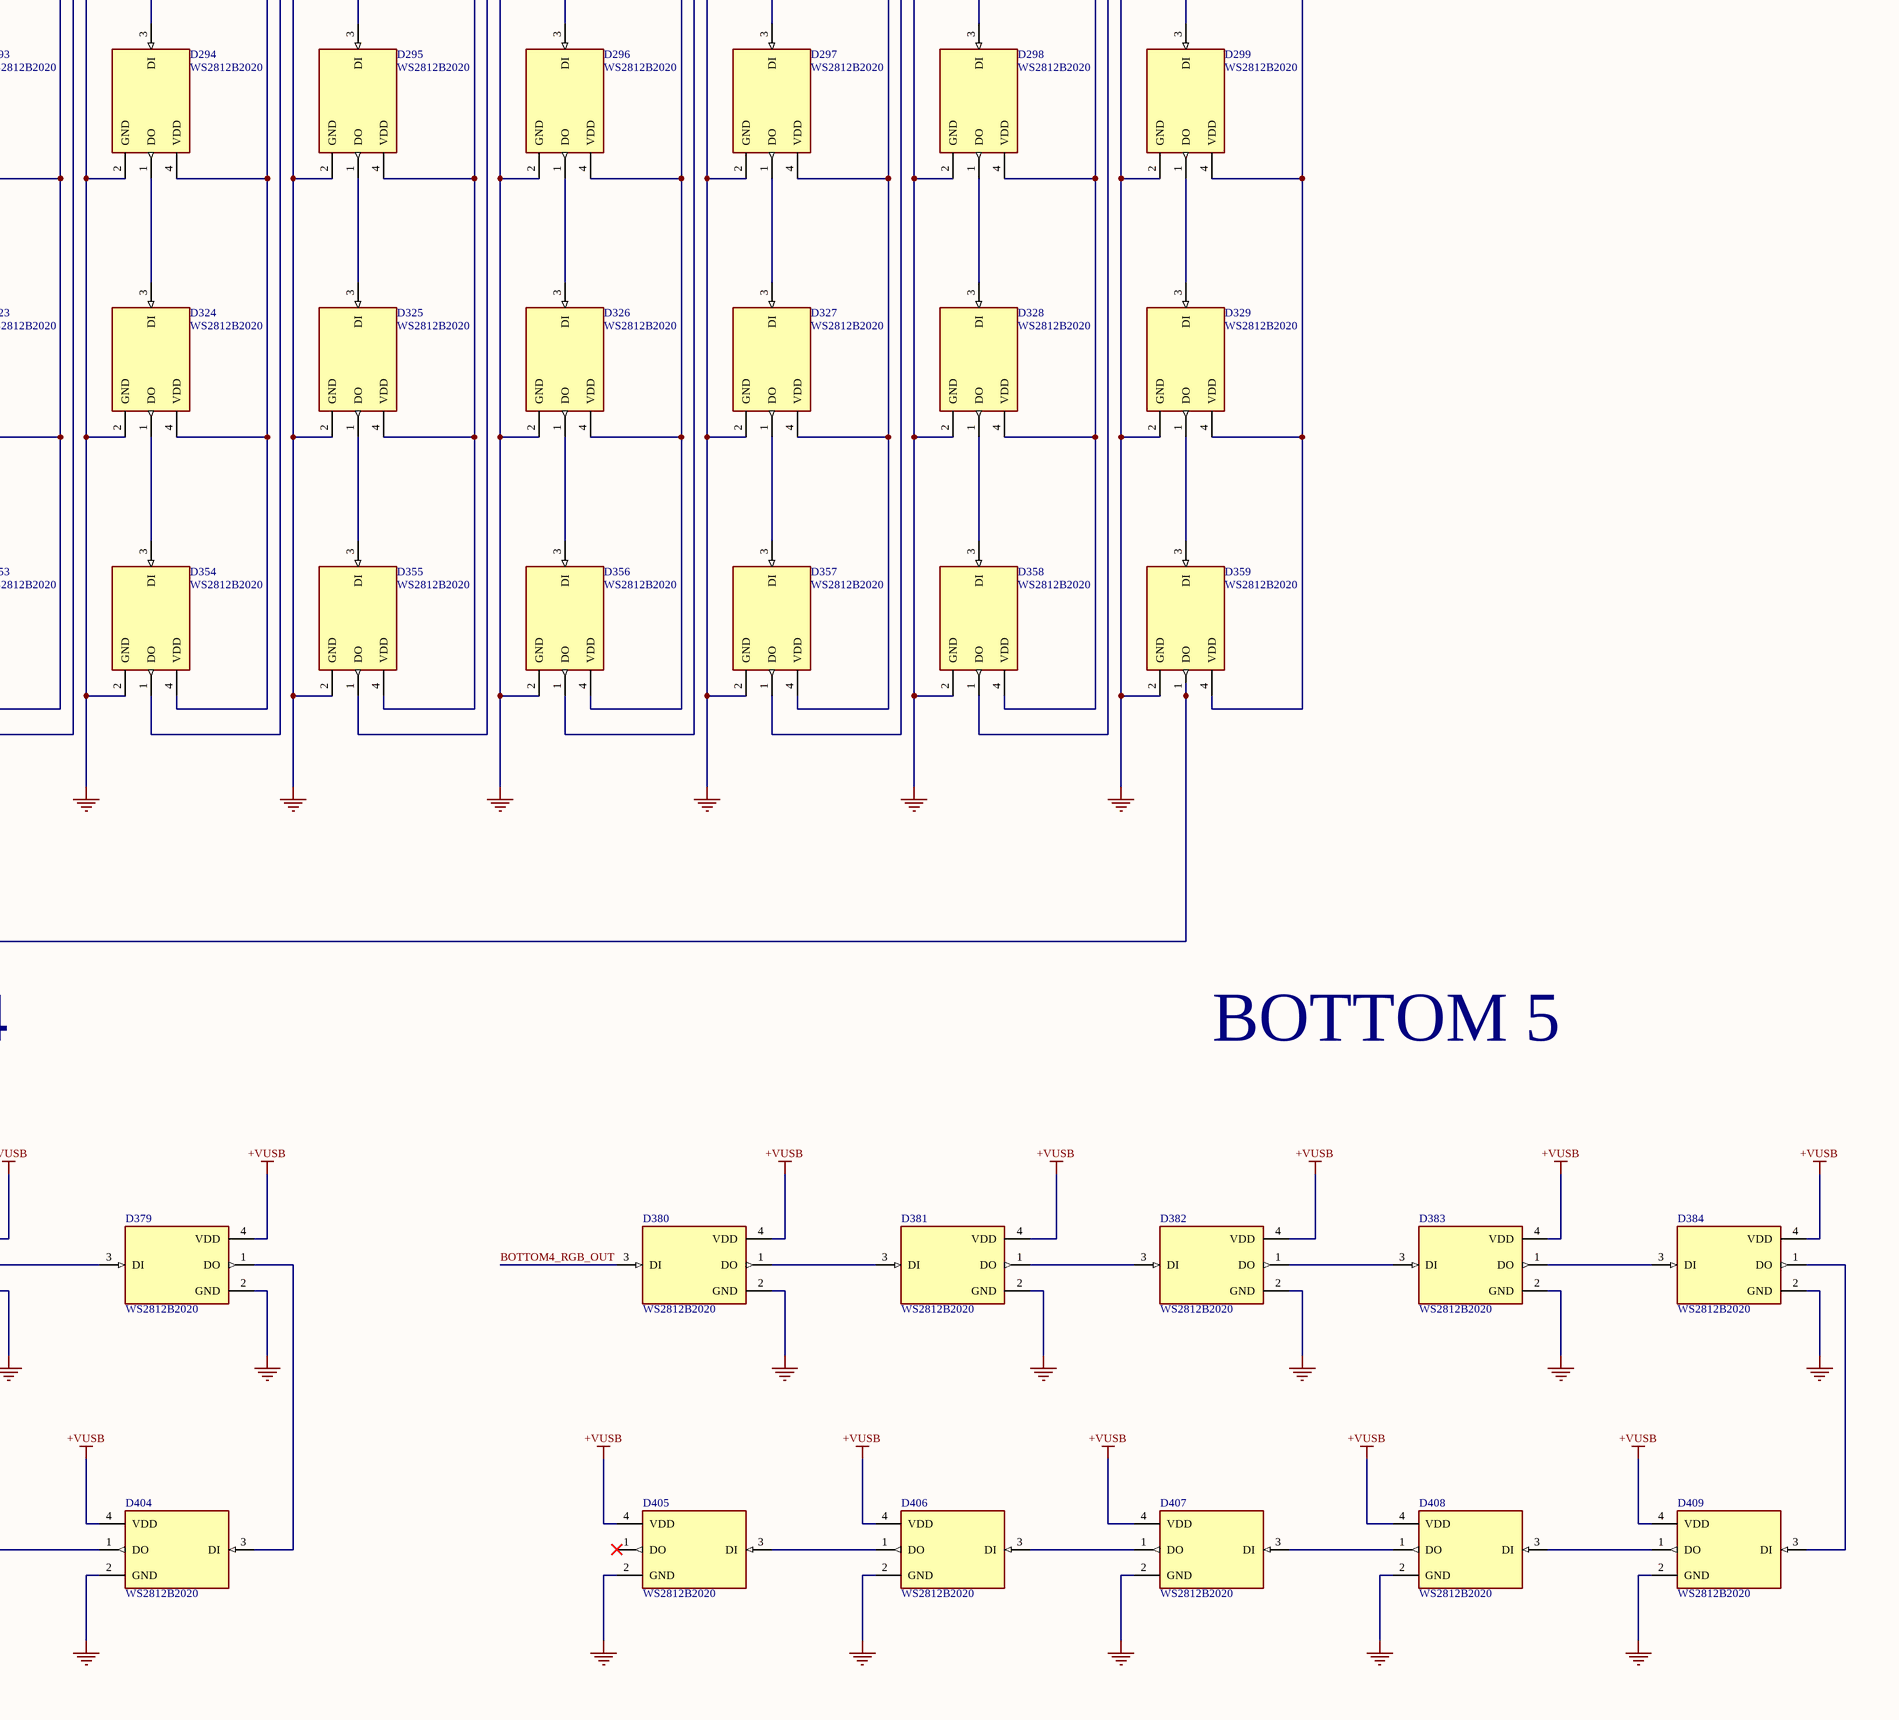
[diagram p27: WS2812B_ARRAY.SchDoc, bottom column 4 of 4]

### Parts
D10  WS2812B2020  [XL-1010RGBC-WS2812B]
D11  WS2812B2020  [XL-1010RGBC-WS2812B]
D12  WS2812B2020  [XL-1010RGBC-WS2812B]
D13  WS2812B2020  [XL-1010RGBC-WS2812B]
D14  WS2812B2020  [XL-1010RGBC-WS2812B]
D15  WS2812B2020  [XL-1010RGBC-WS2812B]
D16  WS2812B2020  [XL-1010RGBC-WS2812B]
D17  WS2812B2020  [XL-1010RGBC-WS2812B]
D18  WS2812B2020  [XL-1010RGBC-WS2812B]
D19  WS2812B2020  [XL-1010RGBC-WS2812B]
D20  WS2812B2020  [XL-1010RGBC-WS2812B]
D21  WS2812B2020  [XL-1010RGBC-WS2812B]
D22  WS2812B2020  [XL-1010RGBC-WS2812B]
D23  WS2812B2020  [XL-1010RGBC-WS2812B]
D24  WS2812B2020  [XL-1010RGBC-WS2812B]
D25  WS2812B2020  [XL-1010RGBC-WS2812B]
D26  WS2812B2020  [XL-1010RGBC-WS2812B]
D27  WS2812B2020  [XL-1010RGBC-WS2812B]
D28  WS2812B2020  [XL-1010RGBC-WS2812B]
D29  WS2812B2020  [XL-1010RGBC-WS2812B]
D30  WS2812B2020  [XL-1010RGBC-WS2812B]
D31  WS2812B2020  [XL-1010RGBC-WS2812B]
D32  WS2812B2020  [XL-1010RGBC-WS2812B]
D33  WS2812B2020  [XL-1010RGBC-WS2812B]
D34  WS2812B2020  [XL-1010RGBC-WS2812B]
D35  WS2812B2020  [XL-1010RGBC-WS2812B]
D36  WS2812B2020  [XL-1010RGBC-WS2812B]
D37  WS2812B2020  [XL-1010RGBC-WS2812B]
D38  WS2812B2020  [XL-1010RGBC-WS2812B]
D39  WS2812B2020  [XL-1010RGBC-WS2812B]
D40  WS2812B2020  [XL-1010RGBC-WS2812B]
D41  WS2812B2020  [XL-1010RGBC-WS2812B]
D42  WS2812B2020  [XL-1010RGBC-WS2812B]
D43  WS2812B2020  [XL-1010RGBC-WS2812B]
D44  WS2812B2020  [XL-1010RGBC-WS2812B]
D45  WS2812B2020  [XL-1010RGBC-WS2812B]
D46  WS2812B2020  [XL-1010RGBC-WS2812B]
D47  WS2812B2020  [XL-1010RGBC-WS2812B]
D48  WS2812B2020  [XL-1010RGBC-WS2812B]
D49  WS2812B2020  [XL-1010RGBC-WS2812B]
D50  WS2812B2020  [XL-1010RGBC-WS2812B]
D51  WS2812B2020  [XL-1010RGBC-WS2812B]
D52  WS2812B2020  [XL-1010RGBC-WS2812B]
D53  WS2812B2020  [XL-1010RGBC-WS2812B]
D54  WS2812B2020  [XL-1010RGBC-WS2812B]
D55  WS2812B2020  [XL-1010RGBC-WS2812B]
D56  WS2812B2020  [XL-1010RGBC-WS2812B]
D57  WS2812B2020  [XL-1010RGBC-WS2812B]
D58  WS2812B2020  [XL-1010RGBC-WS2812B]
D59  WS2812B2020  [XL-1010RGBC-WS2812B]
D60  WS2812B2020  [XL-1010RGBC-WS2812B]
D61  WS2812B2020  [XL-1010RGBC-WS2812B]
D62  WS2812B2020  [XL-1010RGBC-WS2812B]
D63  WS2812B2020  [XL-1010RGBC-WS2812B]
D64  WS2812B2020  [XL-1010RGBC-WS2812B]
D65  WS2812B2020  [XL-1010RGBC-WS2812B]
D66  WS2812B2020  [XL-1010RGBC-WS2812B]
D67  WS2812B2020  [XL-1010RGBC-WS2812B]
D68  WS2812B2020  [XL-1010RGBC-WS2812B]
D69  WS2812B2020  [XL-1010RGBC-WS2812B]
D70  WS2812B2020  [XL-1010RGBC-WS2812B]
D71  WS2812B2020  [XL-1010RGBC-WS2812B]
D72  WS2812B2020  [XL-1010RGBC-WS2812B]
D73  WS2812B2020  [XL-1010RGBC-WS2812B]
D74  WS2812B2020  [XL-1010RGBC-WS2812B]
D75  WS2812B2020  [XL-1010RGBC-WS2812B]
D76  WS2812B2020  [XL-1010RGBC-WS2812B]
D77  WS2812B2020  [XL-1010RGBC-WS2812B]
D78  WS2812B2020  [XL-1010RGBC-WS2812B]
D79  WS2812B2020  [XL-1010RGBC-WS2812B]
D80  WS2812B2020  [XL-1010RGBC-WS2812B]
D81  WS2812B2020  [XL-1010RGBC-WS2812B]
D82  WS2812B2020  [XL-1010RGBC-WS2812B]
D83  WS2812B2020  [XL-1010RGBC-WS2812B]
D84  WS2812B2020  [XL-1010RGBC-WS2812B]
D85  WS2812B2020  [XL-1010RGBC-WS2812B]
D86  WS2812B2020  [XL-1010RGBC-WS2812B]
D87  WS2812B2020  [XL-1010RGBC-WS2812B]
D88  WS2812B2020  [XL-1010RGBC-WS2812B]
D89  WS2812B2020  [XL-1010RGBC-WS2812B]
D90  WS2812B2020  [XL-1010RGBC-WS2812B]
D91  WS2812B2020  [XL-1010RGBC-WS2812B]
D92  WS2812B2020  [XL-1010RGBC-WS2812B]
D93  WS2812B2020  [XL-1010RGBC-WS2812B]
D94  WS2812B2020  [XL-1010RGBC-WS2812B]
D95  WS2812B2020  [XL-1010RGBC-WS2812B]
D96  WS2812B2020  [XL-1010RGBC-WS2812B]
D97  WS2812B2020  [XL-1010RGBC-WS2812B]
D98  WS2812B2020  [XL-1010RGBC-WS2812B]
D99  WS2812B2020  [XL-1010RGBC-WS2812B]
D100  WS2812B2020  [XL-1010RGBC-WS2812B]
D101  WS2812B2020  [XL-1010RGBC-WS2812B]
D102  WS2812B2020  [XL-1010RGBC-WS2812B]
D103  WS2812B2020  [XL-1010RGBC-WS2812B]
D104  WS2812B2020  [XL-1010RGBC-WS2812B]
D105  WS2812B2020  [XL-1010RGBC-WS2812B]
D106  WS2812B2020  [XL-1010RGBC-WS2812B]
D107  WS2812B2020  [XL-1010RGBC-WS2812B]
D108  WS2812B2020  [XL-1010RGBC-WS2812B]
D109  WS2812B2020  [XL-1010RGBC-WS2812B]
D110  WS2812B2020  [XL-1010RGBC-WS2812B]
D111  WS2812B2020  [XL-1010RGBC-WS2812B]
D112  WS2812B2020  [XL-1010RGBC-WS2812B]
D113  WS2812B2020  [XL-1010RGBC-WS2812B]
D114  WS2812B2020  [XL-1010RGBC-WS2812B]
D115  WS2812B2020  [XL-1010RGBC-WS2812B]
D116  WS2812B2020  [XL-1010RGBC-WS2812B]
D117  WS2812B2020  [XL-1010RGBC-WS2812B]
D118  WS2812B2020  [XL-1010RGBC-WS2812B]
D119  WS2812B2020  [XL-1010RGBC-WS2812B]
D120  WS2812B2020  [XL-1010RGBC-WS2812B]
D121  WS2812B2020  [XL-1010RGBC-WS2812B]
D122  WS2812B2020  [XL-1010RGBC-WS2812B]
D123  WS2812B2020  [XL-1010RGBC-WS2812B]
D124  WS2812B2020  [XL-1010RGBC-WS2812B]
D125  WS2812B2020  [XL-1010RGBC-WS2812B]
D126  WS2812B2020  [XL-1010RGBC-WS2812B]
D127  WS2812B2020  [XL-1010RGBC-WS2812B]
D128  WS2812B2020  [XL-1010RGBC-WS2812B]
D129  WS2812B2020  [XL-1010RGBC-WS2812B]
D130  WS2812B2020  [XL-1010RGBC-WS2812B]
D131  WS2812B2020  [XL-1010RGBC-WS2812B]
D132  WS2812B2020  [XL-1010RGBC-WS2812B]
D133  WS2812B2020  [XL-1010RGBC-WS2812B]
D134  WS2812B2020  [XL-1010RGBC-WS2812B]
D135  WS2812B2020  [XL-1010RGBC-WS2812B]
D136  WS2812B2020  [XL-1010RGBC-WS2812B]
D137  WS2812B2020  [XL-1010RGBC-WS2812B]
D138  WS2812B2020  [XL-1010RGBC-WS2812B]
D139  WS2812B2020  [XL-1010RGBC-WS2812B]
D140  WS2812B2020  [XL-1010RGBC-WS2812B]
D141  WS2812B2020  [XL-1010RGBC-WS2812B]
D142  WS2812B2020  [XL-1010RGBC-WS2812B]
D143  WS2812B2020  [XL-1010RGBC-WS2812B]
D144  WS2812B2020  [XL-1010RGBC-WS2812B]
D145  WS2812B2020  [XL-1010RGBC-WS2812B]
D146  WS2812B2020  [XL-1010RGBC-WS2812B]
D147  WS2812B2020  [XL-1010RGBC-WS2812B]
D148  WS2812B2020  [XL-1010RGBC-WS2812B]
D149  WS2812B2020  [XL-1010RGBC-WS2812B]
D150  WS2812B2020  [XL-1010RGBC-WS2812B]
D151  WS2812B2020  [XL-1010RGBC-WS2812B]
D152  WS2812B2020  [XL-1010RGBC-WS2812B]
D153  WS2812B2020  [XL-1010RGBC-WS2812B]
D154  WS2812B2020  [XL-1010RGBC-WS2812B]
D155  WS2812B2020  [XL-1010RGBC-WS2812B]
D156  WS2812B2020  [XL-1010RGBC-WS2812B]
D157  WS2812B2020  [XL-1010RGBC-WS2812B]
D158  WS2812B2020  [XL-1010RGBC-WS2812B]
D159  WS2812B2020  [XL-1010RGBC-WS2812B]
D160  WS2812B2020  [XL-1010RGBC-WS2812B]
D161  WS2812B2020  [XL-1010RGBC-WS2812B]
D162  WS2812B2020  [XL-1010RGBC-WS2812B]
D163  WS2812B2020  [XL-1010RGBC-WS2812B]
D164  WS2812B2020  [XL-1010RGBC-WS2812B]
D165  WS2812B2020  [XL-1010RGBC-WS2812B]
D166  WS2812B2020  [XL-1010RGBC-WS2812B]
D167  WS2812B2020  [XL-1010RGBC-WS2812B]
D168  WS2812B2020  [XL-1010RGBC-WS2812B]
D169  WS2812B2020  [XL-1010RGBC-WS2812B]
D170  WS2812B2020  [XL-1010RGBC-WS2812B]
D171  WS2812B2020  [XL-1010RGBC-WS2812B]
D172  WS2812B2020  [XL-1010RGBC-WS2812B]
D173  WS2812B2020  [XL-1010RGBC-WS2812B]
D174  WS2812B2020  [XL-1010RGBC-WS2812B]
D175  WS2812B2020  [XL-1010RGBC-WS2812B]
D176  WS2812B2020  [XL-1010RGBC-WS2812B]
D177  WS2812B2020  [XL-1010RGBC-WS2812B]
D178  WS2812B2020  [XL-1010RGBC-WS2812B]
D179  WS2812B2020  [XL-1010RGBC-WS2812B]
D180  WS2812B2020  [XL-1010RGBC-WS2812B]
D181  WS2812B2020  [XL-1010RGBC-WS2812B]
D182  WS2812B2020  [XL-1010RGBC-WS2812B]
D183  WS2812B2020  [XL-1010RGBC-WS2812B]
D184  WS2812B2020  [XL-1010RGBC-WS2812B]
D185  WS2812B2020  [XL-1010RGBC-WS2812B]
D186  WS2812B2020  [XL-1010RGBC-WS2812B]
D187  WS2812B2020  [XL-1010RGBC-WS2812B]
D188  WS2812B2020  [XL-1010RGBC-WS2812B]
D189  WS2812B2020  [XL-1010RGBC-WS2812B]
D190  WS2812B2020  [XL-1010RGBC-WS2812B]
D191  WS2812B2020  [XL-1010RGBC-WS2812B]
D192  WS2812B2020  [XL-1010RGBC-WS2812B]
D193  WS2812B2020  [XL-1010RGBC-WS2812B]
D194  WS2812B2020  [XL-1010RGBC-WS2812B]
D195  WS2812B2020  [XL-1010RGBC-WS2812B]
D196  WS2812B2020  [XL-1010RGBC-WS2812B]
D197  WS2812B2020  [XL-1010RGBC-WS2812B]
D198  WS2812B2020  [XL-1010RGBC-WS2812B]
D199  WS2812B2020  [XL-1010RGBC-WS2812B]
D200  WS2812B2020  [XL-1010RGBC-WS2812B]
D201  WS2812B2020  [XL-1010RGBC-WS2812B]
D202  WS2812B2020  [XL-1010RGBC-WS2812B]
D203  WS2812B2020  [XL-1010RGBC-WS2812B]
D204  WS2812B2020  [XL-1010RGBC-WS2812B]
D205  WS2812B2020  [XL-1010RGBC-WS2812B]
D206  WS2812B2020  [XL-1010RGBC-WS2812B]
D207  WS2812B2020  [XL-1010RGBC-WS2812B]
D208  WS2812B2020  [XL-1010RGBC-WS2812B]
D209  WS2812B2020  [XL-1010RGBC-WS2812B]
D210  WS2812B2020  [XL-1010RGBC-WS2812B]
D211  WS2812B2020  [XL-1010RGBC-WS2812B]
D212  WS2812B2020  [XL-1010RGBC-WS2812B]
D213  WS2812B2020  [XL-1010RGBC-WS2812B]
D214  WS2812B2020  [XL-1010RGBC-WS2812B]
D215  WS2812B2020  [XL-1010RGBC-WS2812B]
D216  WS2812B2020  [XL-1010RGBC-WS2812B]
D217  WS2812B2020  [XL-1010RGBC-WS2812B]
D218  WS2812B2020  [XL-1010RGBC-WS2812B]
D219  WS2812B2020  [XL-1010RGBC-WS2812B]
D220  WS2812B2020  [XL-1010RGBC-WS2812B]
D221  WS2812B2020  [XL-1010RGBC-WS2812B]
D222  WS2812B2020  [XL-1010RGBC-WS2812B]
D223  WS2812B2020  [XL-1010RGBC-WS2812B]
D224  WS2812B2020  [XL-1010RGBC-WS2812B]
D225  WS2812B2020  [XL-1010RGBC-WS2812B]
D226  WS2812B2020  [XL-1010RGBC-WS2812B]
D227  WS2812B2020  [XL-1010RGBC-WS2812B]
D228  WS2812B2020  [XL-1010RGBC-WS2812B]
D229  WS2812B2020  [XL-1010RGBC-WS2812B]
D230  WS2812B2020  [XL-1010RGBC-WS2812B]
D231  WS2812B2020  [XL-1010RGBC-WS2812B]
D232  WS2812B2020  [XL-1010RGBC-WS2812B]
D233  WS2812B2020  [XL-1010RGBC-WS2812B]
D234  WS2812B2020  [XL-1010RGBC-WS2812B]
D235  WS2812B2020  [XL-1010RGBC-WS2812B]
D236  WS2812B2020  [XL-1010RGBC-WS2812B]
D237  WS2812B2020  [XL-1010RGBC-WS2812B]
D238  WS2812B2020  [XL-1010RGBC-WS2812B]
D239  WS2812B2020  [XL-1010RGBC-WS2812B]
D240  WS2812B2020  [XL-1010RGBC-WS2812B]
D241  WS2812B2020  [XL-1010RGBC-WS2812B]
D242  WS2812B2020  [XL-1010RGBC-WS2812B]
D243  WS2812B2020  [XL-1010RGBC-WS2812B]
D244  WS2812B2020  [XL-1010RGBC-WS2812B]
D245  WS2812B2020  [XL-1010RGBC-WS2812B]
D246  WS2812B2020  [XL-1010RGBC-WS2812B]
D247  WS2812B2020  [XL-1010RGBC-WS2812B]
D248  WS2812B2020  [XL-1010RGBC-WS2812B]
D249  WS2812B2020  [XL-1010RGBC-WS2812B]
D250  WS2812B2020  [XL-1010RGBC-WS2812B]
D251  WS2812B2020  [XL-1010RGBC-WS2812B]
D252  WS2812B2020  [XL-1010RGBC-WS2812B]
D253  WS2812B2020  [XL-1010RGBC-WS2812B]
D254  WS2812B2020  [XL-1010RGBC-WS2812B]
D255  WS2812B2020  [XL-1010RGBC-WS2812B]
D256  WS2812B2020  [XL-1010RGBC-WS2812B]
D257  WS2812B2020  [XL-1010RGBC-WS2812B]
D258  WS2812B2020  [XL-1010RGBC-WS2812B]
D259  WS2812B2020  [XL-1010RGBC-WS2812B]
D260  WS2812B2020  [XL-1010RGBC-WS2812B]
D261  WS2812B2020  [XL-1010RGBC-WS2812B]
D262  WS2812B2020  [XL-1010RGBC-WS2812B]
D263  WS2812B2020  [XL-1010RGBC-WS2812B]
D264  WS2812B2020  [XL-1010RGBC-WS2812B]
D265  WS2812B2020  [XL-1010RGBC-WS2812B]
D266  WS2812B2020  [XL-1010RGBC-WS2812B]
D267  WS2812B2020  [XL-1010RGBC-WS2812B]
D268  WS2812B2020  [XL-1010RGBC-WS2812B]
D269  WS2812B2020  [XL-1010RGBC-WS2812B]
D270  WS2812B2020  [XL-1010RGBC-WS2812B]
D271  WS2812B2020  [XL-1010RGBC-WS2812B]
D272  WS2812B2020  [XL-1010RGBC-WS2812B]
D273  WS2812B2020  [XL-1010RGBC-WS2812B]
D274  WS2812B2020  [XL-1010RGBC-WS2812B]
D275  WS2812B2020  [XL-1010RGBC-WS2812B]
D276  WS2812B2020  [XL-1010RGBC-WS2812B]
D277  WS2812B2020  [XL-1010RGBC-WS2812B]
D278  WS2812B2020  [XL-1010RGBC-WS2812B]
D279  WS2812B2020  [XL-1010RGBC-WS2812B]
D280  WS2812B2020  [XL-1010RGBC-WS2812B]
D281  WS2812B2020  [XL-1010RGBC-WS2812B]
D282  WS2812B2020  [XL-1010RGBC-WS2812B]
D283  WS2812B2020  [XL-1010RGBC-WS2812B]
D284  WS2812B2020  [XL-1010RGBC-WS2812B]
D285  WS2812B2020  [XL-1010RGBC-WS2812B]
D286  WS2812B2020  [XL-1010RGBC-WS2812B]
D287  WS2812B2020  [XL-1010RGBC-WS2812B]
D288  WS2812B2020  [XL-1010RGBC-WS2812B]
D289  WS2812B2020  [XL-1010RGBC-WS2812B]
D290  WS2812B2020  [XL-1010RGBC-WS2812B]
D291  WS2812B2020  [XL-1010RGBC-WS2812B]
D292  WS2812B2020  [XL-1010RGBC-WS2812B]
D293  WS2812B2020  [XL-1010RGBC-WS2812B]
D294  WS2812B2020  [XL-1010RGBC-WS2812B]
D295  WS2812B2020  [XL-1010RGBC-WS2812B]
D296  WS2812B2020  [XL-1010RGBC-WS2812B]
D297  WS2812B2020  [XL-1010RGBC-WS2812B]
D298  WS2812B2020  [XL-1010RGBC-WS2812B]
D299  WS2812B2020  [XL-1010RGBC-WS2812B]
D300  WS2812B2020  [XL-1010RGBC-WS2812B]
D301  WS2812B2020  [XL-1010RGBC-WS2812B]
D302  WS2812B2020  [XL-1010RGBC-WS2812B]
D303  WS2812B2020  [XL-1010RGBC-WS2812B]
D304  WS2812B2020  [XL-1010RGBC-WS2812B]
D305  WS2812B2020  [XL-1010RGBC-WS2812B]
D306  WS2812B2020  [XL-1010RGBC-WS2812B]
D307  WS2812B2020  [XL-1010RGBC-WS2812B]
D308  WS2812B2020  [XL-1010RGBC-WS2812B]
D309  WS2812B2020  [XL-1010RGBC-WS2812B]
D310  WS2812B2020  [XL-1010RGBC-WS2812B]
D311  WS2812B2020  [XL-1010RGBC-WS2812B]
D312  WS2812B2020  [XL-1010RGBC-WS2812B]
D313  WS2812B2020  [XL-1010RGBC-WS2812B]
D314  WS2812B2020  [XL-1010RGBC-WS2812B]
D315  WS2812B2020  [XL-1010RGBC-WS2812B]
D316  WS2812B2020  [XL-1010RGBC-WS2812B]
D317  WS2812B2020  [XL-1010RGBC-WS2812B]
D318  WS2812B2020  [XL-1010RGBC-WS2812B]
D319  WS2812B2020  [XL-1010RGBC-WS2812B]
D320  WS2812B2020  [XL-1010RGBC-WS2812B]
D321  WS2812B2020  [XL-1010RGBC-WS2812B]
D322  WS2812B2020  [XL-1010RGBC-WS2812B]
D323  WS2812B2020  [XL-1010RGBC-WS2812B]
D324  WS2812B2020  [XL-1010RGBC-WS2812B]
D325  WS2812B2020  [XL-1010RGBC-WS2812B]
D326  WS2812B2020  [XL-1010RGBC-WS2812B]
D327  WS2812B2020  [XL-1010RGBC-WS2812B]
D328  WS2812B2020  [XL-1010RGBC-WS2812B]
D329  WS2812B2020  [XL-1010RGBC-WS2812B]
D330  WS2812B2020  [XL-1010RGBC-WS2812B]
D331  WS2812B2020  [XL-1010RGBC-WS2812B]
D332  WS2812B2020  [XL-1010RGBC-WS2812B]
D333  WS2812B2020  [XL-1010RGBC-WS2812B]
D334  WS2812B2020  [XL-1010RGBC-WS2812B]
D335  WS2812B2020  [XL-1010RGBC-WS2812B]
D336  WS2812B2020  [XL-1010RGBC-WS2812B]
D337  WS2812B2020  [XL-1010RGBC-WS2812B]
D338  WS2812B2020  [XL-1010RGBC-WS2812B]
D339  WS2812B2020  [XL-1010RGBC-WS2812B]
D340  WS2812B2020  [XL-1010RGBC-WS2812B]
D341  WS2812B2020  [XL-1010RGBC-WS2812B]
D342  WS2812B2020  [XL-1010RGBC-WS2812B]
D343  WS2812B2020  [XL-1010RGBC-WS2812B]
D344  WS2812B2020  [XL-1010RGBC-WS2812B]
D345  WS2812B2020  [XL-1010RGBC-WS2812B]
D346  WS2812B2020  [XL-1010RGBC-WS2812B]
D347  WS2812B2020  [XL-1010RGBC-WS2812B]
D348  WS2812B2020  [XL-1010RGBC-WS2812B]
D349  WS2812B2020  [XL-1010RGBC-WS2812B]
D350  WS2812B2020  [XL-1010RGBC-WS2812B]
D351  WS2812B2020  [XL-1010RGBC-WS2812B]
D352  WS2812B2020  [XL-1010RGBC-WS2812B]
D353  WS2812B2020  [XL-1010RGBC-WS2812B]
D354  WS2812B2020  [XL-1010RGBC-WS2812B]
D355  WS2812B2020  [XL-1010RGBC-WS2812B]
D356  WS2812B2020  [XL-1010RGBC-WS2812B]
D357  WS2812B2020  [XL-1010RGBC-WS2812B]
D358  WS2812B2020  [XL-1010RGBC-WS2812B]
D359  WS2812B2020  [XL-1010RGBC-WS2812B]
D360  WS2812B2020  [XL-1010RGBC-WS2812B]
D361  WS2812B2020  [XL-1010RGBC-WS2812B]
D362  WS2812B2020  [XL-1010RGBC-WS2812B]
D363  WS2812B2020  [XL-1010RGBC-WS2812B]
D364  WS2812B2020  [XL-1010RGBC-WS2812B]
D365  WS2812B2020  [XL-1010RGBC-WS2812B]
D366  WS2812B2020  [XL-1010RGBC-WS2812B]
D367  WS2812B2020  [XL-1010RGBC-WS2812B]
D368  WS2812B2020  [XL-1010RGBC-WS2812B]
D369  WS2812B2020  [XL-1010RGBC-WS2812B]
D370  WS2812B2020  [XL-1010RGBC-WS2812B]
D371  WS2812B2020  [XL-1010RGBC-WS2812B]
D372  WS2812B2020  [XL-1010RGBC-WS2812B]
D373  WS2812B2020  [XL-1010RGBC-WS2812B]
D374  WS2812B2020  [XL-1010RGBC-WS2812B]
D375  WS2812B2020  [XL-1010RGBC-WS2812B]
D376  WS2812B2020  [XL-1010RGBC-WS2812B]
D377  WS2812B2020  [XL-1010RGBC-WS2812B]
D378  WS2812B2020  [XL-1010RGBC-WS2812B]
D379  WS2812B2020  [XL-1010RGBC-WS2812B]
D380  WS2812B2020  [XL-1010RGBC-WS2812B]
D381  WS2812B2020  [XL-1010RGBC-WS2812B]
D382  WS2812B2020  [XL-1010RGBC-WS2812B]
D383  WS2812B2020  [XL-1010RGBC-WS2812B]
D384  WS2812B2020  [XL-1010RGBC-WS2812B]
D385  WS2812B2020  [XL-1010RGBC-WS2812B]
D386  WS2812B2020  [XL-1010RGBC-WS2812B]
D387  WS2812B2020  [XL-1010RGBC-WS2812B]
D388  WS2812B2020  [XL-1010RGBC-WS2812B]
D389  WS2812B2020  [XL-1010RGBC-WS2812B]
D390  WS2812B2020  [XL-1010RGBC-WS2812B]
D391  WS2812B2020  [XL-1010RGBC-WS2812B]
D392  WS2812B2020  [XL-1010RGBC-WS2812B]
D393  WS2812B2020  [XL-1010RGBC-WS2812B]
D394  WS2812B2020  [XL-1010RGBC-WS2812B]
D395  WS2812B2020  [XL-1010RGBC-WS2812B]
D396  WS2812B2020  [XL-1010RGBC-WS2812B]
D397  WS2812B2020  [XL-1010RGBC-WS2812B]
D398  WS2812B2020  [XL-1010RGBC-WS2812B]
D399  WS2812B2020  [XL-1010RGBC-WS2812B]
D400  WS2812B2020  [XL-1010RGBC-WS2812B]
D401  WS2812B2020  [XL-1010RGBC-WS2812B]
D402  WS2812B2020  [XL-1010RGBC-WS2812B]
D403  WS2812B2020  [XL-1010RGBC-WS2812B]
D404  WS2812B2020  [XL-1010RGBC-WS2812B]
D405  WS2812B2020  [XL-1010RGBC-WS2812B]
D406  WS2812B2020  [XL-1010RGBC-WS2812B]
D407  WS2812B2020  [XL-1010RGBC-WS2812B]
D408  WS2812B2020  [XL-1010RGBC-WS2812B]
D409  WS2812B2020  [XL-1010RGBC-WS2812B]

### Ports
RGB_LED_DRIVE_IN (bidir)

### Nets
+VUSB: D10.4(VDD) D11.4(VDD) D12.4(VDD) D13.4(VDD) D14.4(VDD) D15.4(VDD) D16.4(VDD) D17.4(VDD) D18.4(VDD) D19.4(VDD) D20.4(VDD) D21.4(VDD) D22.4(VDD) D23.4(VDD) D24.4(VDD) D25.4(VDD) D26.4(VDD) D27.4(VDD) D28.4(VDD) D29.4(VDD) D30.4(VDD) D31.4(VDD) D32.4(VDD) D33.4(VDD) D34.4(VDD) D35.4(VDD) D36.4(VDD) D37.4(VDD) D38.4(VDD) D39.4(VDD) D40.4(VDD) D41.4(VDD) D42.4(VDD) D43.4(VDD) D44.4(VDD) D45.4(VDD) D46.4(VDD) D47.4(VDD) D48.4(VDD) D49.4(VDD) D50.4(VDD) D51.4(VDD) D52.4(VDD) D53.4(VDD) D54.4(VDD) D55.4(VDD) D56.4(VDD) D57.4(VDD) D58.4(VDD) D59.4(VDD) D60.4(VDD) D61.4(VDD) D62.4(VDD) D63.4(VDD) D64.4(VDD) D65.4(VDD) D66.4(VDD) D67.4(VDD) D68.4(VDD) D69.4(VDD) D70.4(VDD) D71.4(VDD) D72.4(VDD) D73.4(VDD) D74.4(VDD) D75.4(VDD) D76.4(VDD) D77.4(VDD) D78.4(VDD) D79.4(VDD) D80.4(VDD) D81.4(VDD) D82.4(VDD) D83.4(VDD) D84.4(VDD) D85.4(VDD) D86.4(VDD) D87.4(VDD) D88.4(VDD) D89.4(VDD) D90.4(VDD) D91.4(VDD) D92.4(VDD) D93.4(VDD) D94.4(VDD) D95.4(VDD) D96.4(VDD) D97.4(VDD) D98.4(VDD) D99.4(VDD) D100.4(VDD) D101.4(VDD) D102.4(VDD) D103.4(VDD) D104.4(VDD) D105.4(VDD) D106.4(VDD) D107.4(VDD) D108.4(VDD) D109.4(VDD) D110.4(VDD) D111.4(VDD) D112.4(VDD) D113.4(VDD) D114.4(VDD) D115.4(VDD) D116.4(VDD) D117.4(VDD) D118.4(VDD) D119.4(VDD) D120.4(VDD) D121.4(VDD) D122.4(VDD) D123.4(VDD) D124.4(VDD) D125.4(VDD) D126.4(VDD) D127.4(VDD) D128.4(VDD) D129.4(VDD) D130.4(VDD) D131.4(VDD) D132.4(VDD) D133.4(VDD) D134.4(VDD) D135.4(VDD) D136.4(VDD) D137.4(VDD) D138.4(VDD) D139.4(VDD) D140.4(VDD) D141.4(VDD) D142.4(VDD) D143.4(VDD) D144.4(VDD) D145.4(VDD) D146.4(VDD) D147.4(VDD) D148.4(VDD) D149.4(VDD) D150.4(VDD) D151.4(VDD) D152.4(VDD) D153.4(VDD) D154.4(VDD) D155.4(VDD) D156.4(VDD) D157.4(VDD) D158.4(VDD) D159.4(VDD) D160.4(VDD) D161.4(VDD) D162.4(VDD) D163.4(VDD) D164.4(VDD) D165.4(VDD) D166.4(VDD) D167.4(VDD) D168.4(VDD) D169.4(VDD) D170.4(VDD) D171.4(VDD) D172.4(VDD) D173.4(VDD) D174.4(VDD) D175.4(VDD) D176.4(VDD) D177.4(VDD) D178.4(VDD) D179.4(VDD) D180.4(VDD) D181.4(VDD) D182.4(VDD) D183.4(VDD) D184.4(VDD) D185.4(VDD) D186.4(VDD) D187.4(VDD) D188.4(VDD) D189.4(VDD) D190.4(VDD) D191.4(VDD) D192.4(VDD) D193.4(VDD) D194.4(VDD) D195.4(VDD) D196.4(VDD) D197.4(VDD) D198.4(VDD) D199.4(VDD) D200.4(VDD) D201.4(VDD) D202.4(VDD) D203.4(VDD) D204.4(VDD) D205.4(VDD) D206.4(VDD) D207.4(VDD) D208.4(VDD) D209.4(VDD) D210.4(VDD) D211.4(VDD) D212.4(VDD) D213.4(VDD) D214.4(VDD) D215.4(VDD) D216.4(VDD) D217.4(VDD) D218.4(VDD) D219.4(VDD) D220.4(VDD) D221.4(VDD) D222.4(VDD) D223.4(VDD) D224.4(VDD) D225.4(VDD) D226.4(VDD) D227.4(VDD) D228.4(VDD) D229.4(VDD) D230.4(VDD) D231.4(VDD) D232.4(VDD) D233.4(VDD) D234.4(VDD) D235.4(VDD) D236.4(VDD) D237.4(VDD) D238.4(VDD) D239.4(VDD) D240.4(VDD) D241.4(VDD) D242.4(VDD) D243.4(VDD) D244.4(VDD) D245.4(VDD) D246.4(VDD) D247.4(VDD) D248.4(VDD) D249.4(VDD) D250.4(VDD) D251.4(VDD) D252.4(VDD) D253.4(VDD) D254.4(VDD) D255.4(VDD) D256.4(VDD) D257.4(VDD) D258.4(VDD) D259.4(VDD) D260.4(VDD) D261.4(VDD) D262.4(VDD) D263.4(VDD) D264.4(VDD) D265.4(VDD) D266.4(VDD) D267.4(VDD) D268.4(VDD) D269.4(VDD) D270.4(VDD) D271.4(VDD) D272.4(VDD) D273.4(VDD) D274.4(VDD) D275.4(VDD) D276.4(VDD) D277.4(VDD) D278.4(VDD) D279.4(VDD) D280.4(VDD) D281.4(VDD) D282.4(VDD) D283.4(VDD) D284.4(VDD) D285.4(VDD) D286.4(VDD) D287.4(VDD) D288.4(VDD) D289.4(VDD) D290.4(VDD) D291.4(VDD) D292.4(VDD) D293.4(VDD) D294.4(VDD) D295.4(VDD) D296.4(VDD) D297.4(VDD) D298.4(VDD) D299.4(VDD) D300.4(VDD) D301.4(VDD) D302.4(VDD) D303.4(VDD) D304.4(VDD) D305.4(VDD) D306.4(VDD) D307.4(VDD) D308.4(VDD) D309.4(VDD) D310.4(VDD) D311.4(VDD) D312.4(VDD) D313.4(VDD) D314.4(VDD) D315.4(VDD) D316.4(VDD) D317.4(VDD) D318.4(VDD) D319.4(VDD) D320.4(VDD) D321.4(VDD) D322.4(VDD) D323.4(VDD) D324.4(VDD) D325.4(VDD) D326.4(VDD) D327.4(VDD) D328.4(VDD) D329.4(VDD) D330.4(VDD) D331.4(VDD) D332.4(VDD) D333.4(VDD) D334.4(VDD) D335.4(VDD) D336.4(VDD) D337.4(VDD) D338.4(VDD) D339.4(VDD) D340.4(VDD) D341.4(VDD) D342.4(VDD) D343.4(VDD) D344.4(VDD) D345.4(VDD) D346.4(VDD) D347.4(VDD) D348.4(VDD) D349.4(VDD) D350.4(VDD) D351.4(VDD) D352.4(VDD) D353.4(VDD) D354.4(VDD) D355.4(VDD) D356.4(VDD) D357.4(VDD) D358.4(VDD) D359.4(VDD) D360.4(VDD) D361.4(VDD) D362.4(VDD) D363.4(VDD) D364.4(VDD) D365.4(VDD) D366.4(VDD) D367.4(VDD) D368.4(VDD) D369.4(VDD) D370.4(VDD) D371.4(VDD) D372.4(VDD) D373.4(VDD) D374.4(VDD) D375.4(VDD) D376.4(VDD) D377.4(VDD) D378.4(VDD) D379.4(VDD) D380.4(VDD) D381.4(VDD) D382.4(VDD) D383.4(VDD) D384.4(VDD) D385.4(VDD) D386.4(VDD) D387.4(VDD) D388.4(VDD) D389.4(VDD) D390.4(VDD) D391.4(VDD) D392.4(VDD) D393.4(VDD) D394.4(VDD) D395.4(VDD) D396.4(VDD) D397.4(VDD) D398.4(VDD) D399.4(VDD) D400.4(VDD) D401.4(VDD) D402.4(VDD) D403.4(VDD) D404.4(VDD) D405.4(VDD) D406.4(VDD) D407.4(VDD) D408.4(VDD) D409.4(VDD)  [project net ANALOG_5V]
GND: D10.2(GND) D11.2(GND) D12.2(GND) D13.2(GND) D14.2(GND) D15.2(GND) D16.2(GND) D17.2(GND) D18.2(GND) D19.2(GND) D20.2(GND) D21.2(GND) D22.2(GND) D23.2(GND) D24.2(GND) D25.2(GND) D26.2(GND) D27.2(GND) D28.2(GND) D29.2(GND) D30.2(GND) D31.2(GND) D32.2(GND) D33.2(GND) D34.2(GND) D35.2(GND) D36.2(GND) D37.2(GND) D38.2(GND) D39.2(GND) D40.2(GND) D41.2(GND) D42.2(GND) D43.2(GND) D44.2(GND) D45.2(GND) D46.2(GND) D47.2(GND) D48.2(GND) D49.2(GND) D50.2(GND) D51.2(GND) D52.2(GND) D53.2(GND) D54.2(GND) D55.2(GND) D56.2(GND) D57.2(GND) D58.2(GND) D59.2(GND) D60.2(GND) D61.2(GND) D62.2(GND) D63.2(GND) D64.2(GND) D65.2(GND) D66.2(GND) D67.2(GND) D68.2(GND) D69.2(GND) D70.2(GND) D71.2(GND) D72.2(GND) D73.2(GND) D74.2(GND) D75.2(GND) D76.2(GND) D77.2(GND) D78.2(GND) D79.2(GND) D80.2(GND) D81.2(GND) D82.2(GND) D83.2(GND) D84.2(GND) D85.2(GND) D86.2(GND) D87.2(GND) D88.2(GND) D89.2(GND) D90.2(GND) D91.2(GND) D92.2(GND) D93.2(GND) D94.2(GND) D95.2(GND) D96.2(GND) D97.2(GND) D98.2(GND) D99.2(GND) D100.2(GND) D101.2(GND) D102.2(GND) D103.2(GND) D104.2(GND) D105.2(GND) D106.2(GND) D107.2(GND) D108.2(GND) D109.2(GND) D110.2(GND) D111.2(GND) D112.2(GND) D113.2(GND) D114.2(GND) D115.2(GND) D116.2(GND) D117.2(GND) D118.2(GND) D119.2(GND) D120.2(GND) D121.2(GND) D122.2(GND) D123.2(GND) D124.2(GND) D125.2(GND) D126.2(GND) D127.2(GND) D128.2(GND) D129.2(GND) D130.2(GND) D131.2(GND) D132.2(GND) D133.2(GND) D134.2(GND) D135.2(GND) D136.2(GND) D137.2(GND) D138.2(GND) D139.2(GND) D140.2(GND) D141.2(GND) D142.2(GND) D143.2(GND) D144.2(GND) D145.2(GND) D146.2(GND) D147.2(GND) D148.2(GND) D149.2(GND) D150.2(GND) D151.2(GND) D152.2(GND) D153.2(GND) D154.2(GND) D155.2(GND) D156.2(GND) D157.2(GND) D158.2(GND) D159.2(GND) D160.2(GND) D161.2(GND) D162.2(GND) D163.2(GND) D164.2(GND) D165.2(GND) D166.2(GND) D167.2(GND) D168.2(GND) D169.2(GND) D170.2(GND) D171.2(GND) D172.2(GND) D173.2(GND) D174.2(GND) D175.2(GND) D176.2(GND) D177.2(GND) D178.2(GND) D179.2(GND) D180.2(GND) D181.2(GND) D182.2(GND) D183.2(GND) D184.2(GND) D185.2(GND) D186.2(GND) D187.2(GND) D188.2(GND) D189.2(GND) D190.2(GND) D191.2(GND) D192.2(GND) D193.2(GND) D194.2(GND) D195.2(GND) D196.2(GND) D197.2(GND) D198.2(GND) D199.2(GND) D200.2(GND) D201.2(GND) D202.2(GND) D203.2(GND) D204.2(GND) D205.2(GND) D206.2(GND) D207.2(GND) D208.2(GND) D209.2(GND) D210.2(GND) D211.2(GND) D212.2(GND) D213.2(GND) D214.2(GND) D215.2(GND) D216.2(GND) D217.2(GND) D218.2(GND) D219.2(GND) D220.2(GND) D221.2(GND) D222.2(GND) D223.2(GND) D224.2(GND) D225.2(GND) D226.2(GND) D227.2(GND) D228.2(GND) D229.2(GND) D230.2(GND) D231.2(GND) D232.2(GND) D233.2(GND) D234.2(GND) D235.2(GND) D236.2(GND) D237.2(GND) D238.2(GND) D239.2(GND) D240.2(GND) D241.2(GND) D242.2(GND) D243.2(GND) D244.2(GND) D245.2(GND) D246.2(GND) D247.2(GND) D248.2(GND) D249.2(GND) D250.2(GND) D251.2(GND) D252.2(GND) D253.2(GND) D254.2(GND) D255.2(GND) D256.2(GND) D257.2(GND) D258.2(GND) D259.2(GND) D260.2(GND) D261.2(GND) D262.2(GND) D263.2(GND) D264.2(GND) D265.2(GND) D266.2(GND) D267.2(GND) D268.2(GND) D269.2(GND) D270.2(GND) D271.2(GND) D272.2(GND) D273.2(GND) D274.2(GND) D275.2(GND) D276.2(GND) D277.2(GND) D278.2(GND) D279.2(GND) D280.2(GND) D281.2(GND) D282.2(GND) D283.2(GND) D284.2(GND) D285.2(GND) D286.2(GND) D287.2(GND) D288.2(GND) D289.2(GND) D290.2(GND) D291.2(GND) D292.2(GND) D293.2(GND) D294.2(GND) D295.2(GND) D296.2(GND) D297.2(GND) D298.2(GND) D299.2(GND) D300.2(GND) D301.2(GND) D302.2(GND) D303.2(GND) D304.2(GND) D305.2(GND) D306.2(GND) D307.2(GND) D308.2(GND) D309.2(GND) D310.2(GND) D311.2(GND) D312.2(GND) D313.2(GND) D314.2(GND) D315.2(GND) D316.2(GND) D317.2(GND) D318.2(GND) D319.2(GND) D320.2(GND) D321.2(GND) D322.2(GND) D323.2(GND) D324.2(GND) D325.2(GND) D326.2(GND) D327.2(GND) D328.2(GND) D329.2(GND) D330.2(GND) D331.2(GND) D332.2(GND) D333.2(GND) D334.2(GND) D335.2(GND) D336.2(GND) D337.2(GND) D338.2(GND) D339.2(GND) D340.2(GND) D341.2(GND) D342.2(GND) D343.2(GND) D344.2(GND) D345.2(GND) D346.2(GND) D347.2(GND) D348.2(GND) D349.2(GND) D350.2(GND) D351.2(GND) D352.2(GND) D353.2(GND) D354.2(GND) D355.2(GND) D356.2(GND) D357.2(GND) D358.2(GND) D359.2(GND) D360.2(GND) D361.2(GND) D362.2(GND) D363.2(GND) D364.2(GND) D365.2(GND) D366.2(GND) D367.2(GND) D368.2(GND) D369.2(GND) D370.2(GND) D371.2(GND) D372.2(GND) D373.2(GND) D374.2(GND) D375.2(GND) D376.2(GND) D377.2(GND) D378.2(GND) D379.2(GND) D380.2(GND) D381.2(GND) D382.2(GND) D383.2(GND) D384.2(GND) D385.2(GND) D386.2(GND) D387.2(GND) D388.2(GND) D389.2(GND) D390.2(GND) D391.2(GND) D392.2(GND) D393.2(GND) D394.2(GND) D395.2(GND) D396.2(GND) D397.2(GND) D398.2(GND) D399.2(GND) D400.2(GND) D401.2(GND) D402.2(GND) D403.2(GND) D404.2(GND) D405.2(GND) D406.2(GND) D407.2(GND) D408.2(GND) D409.2(GND)  [project net REF]
BOTTOM1_RGB_OUT: D365.3(DI) D385.1(DO)  [project net BOTTOM1_RGB_OUT_8]
BOTTOM2_RGB_OUT: D370.3(DI) D390.1(DO)  [project net BOTTOM2_RGB_OUT_8]
BOTTOM3_RGB_OUT: D375.3(DI) D395.1(DO)  [project net BOTTOM3_RGB_OUT_8]
BOTTOM4_RGB_OUT: D380.3(DI) D400.1(DO)  [project net BOTTOM4_RGB_OUT_8]
RGB30_OUT: D209.1(DO) D210.3(DI)  [project net RGB30_OUT_8]
RGB_CONTROL: D10.3(DI) ; port RGB_LED_DRIVE_IN
TOP1_RGB_OUT: D15.3(DI) D35.1(DO)  [project net TOP1_RGB_OUT_8]
TOP2_RGB_OUT: D20.3(DI) D40.1(DO)  [project net TOP2_RGB_OUT_8]
TOP3_RGB_OUT: D25.3(DI) D45.1(DO)  [project net TOP3_RGB_OUT_8]
TOP4_RGB_OUT: D30.3(DI) D50.1(DO)  [project net TOP4_RGB_OUT_8]
TOP5_RGB_OUT: D55.1(DO) D60.3(DI)  [project net TOP5_RGB_OUT_8]
NetD10_1: D10.1(DO) D11.3(DI)
NetD11_1: D11.1(DO) D12.3(DI)
NetD12_1: D12.1(DO) D13.3(DI)
NetD13_1: D13.1(DO) D14.3(DI)
NetD14_1: D14.1(DO) D39.3(DI)
NetD15_1: D15.1(DO) D16.3(DI)
NetD16_1: D16.1(DO) D17.3(DI)
NetD17_1: D17.1(DO) D18.3(DI)
NetD18_1: D18.1(DO) D19.3(DI)
NetD19_1: D19.1(DO) D44.3(DI)
NetD20_1: D20.1(DO) D21.3(DI)
NetD21_1: D21.1(DO) D22.3(DI)
NetD22_1: D22.1(DO) D23.3(DI)
NetD23_1: D23.1(DO) D24.3(DI)
NetD24_1: D24.1(DO) D49.3(DI)
NetD25_1: D25.1(DO) D26.3(DI)
NetD26_1: D26.1(DO) D27.3(DI)
NetD27_1: D27.1(DO) D28.3(DI)
NetD28_1: D28.1(DO) D29.3(DI)
NetD29_1: D29.1(DO) D54.3(DI)
NetD30_1: D30.1(DO) D31.3(DI)
NetD31_1: D31.1(DO) D32.3(DI)
NetD32_1: D32.1(DO) D33.3(DI)
NetD33_1: D33.1(DO) D34.3(DI)
NetD34_1: D34.1(DO) D59.3(DI)
NetD35_3: D35.3(DI) D36.1(DO)
NetD36_3: D36.3(DI) D37.1(DO)
NetD37_3: D37.3(DI) D38.1(DO)
NetD38_3: D38.3(DI) D39.1(DO)
NetD40_3: D40.3(DI) D41.1(DO)
NetD41_3: D41.3(DI) D42.1(DO)
NetD42_3: D42.3(DI) D43.1(DO)
NetD43_3: D43.3(DI) D44.1(DO)
NetD45_3: D45.3(DI) D46.1(DO)
NetD46_3: D46.3(DI) D47.1(DO)
NetD47_3: D47.3(DI) D48.1(DO)
NetD48_3: D48.3(DI) D49.1(DO)
NetD50_3: D50.3(DI) D51.1(DO)
NetD51_3: D51.3(DI) D52.1(DO)
NetD52_3: D52.3(DI) D53.1(DO)
NetD53_3: D53.3(DI) D54.1(DO)
NetD55_3: D55.3(DI) D56.1(DO)
NetD56_3: D56.3(DI) D57.1(DO)
NetD57_3: D57.3(DI) D58.1(DO)
NetD58_3: D58.3(DI) D59.1(DO)
NetD60_1: D60.1(DO) D90.3(DI)
NetD61_1: D61.1(DO) D91.3(DI)
NetD61_3: D61.3(DI) D180.1(DO)
NetD62_1: D62.1(DO) D92.3(DI)
NetD62_3: D62.3(DI) D181.1(DO)
NetD63_1: D63.1(DO) D93.3(DI)
NetD63_3: D63.3(DI) D182.1(DO)
NetD64_1: D64.1(DO) D94.3(DI)
NetD64_3: D64.3(DI) D183.1(DO)
NetD65_1: D65.1(DO) D95.3(DI)
NetD65_3: D65.3(DI) D184.1(DO)
NetD66_1: D66.1(DO) D96.3(DI)
NetD66_3: D66.3(DI) D185.1(DO)
NetD67_1: D67.1(DO) D97.3(DI)
NetD67_3: D67.3(DI) D186.1(DO)
NetD68_1: D68.1(DO) D98.3(DI)
NetD68_3: D68.3(DI) D187.1(DO)
NetD69_1: D69.1(DO) D99.3(DI)
NetD69_3: D69.3(DI) D188.1(DO)
NetD70_1: D70.1(DO) D100.3(DI)
NetD70_3: D70.3(DI) D189.1(DO)
NetD71_1: D71.1(DO) D101.3(DI)
NetD71_3: D71.3(DI) D190.1(DO)
NetD72_1: D72.1(DO) D102.3(DI)
NetD72_3: D72.3(DI) D191.1(DO)
NetD73_1: D73.1(DO) D103.3(DI)
NetD73_3: D73.3(DI) D192.1(DO)
NetD74_1: D74.1(DO) D104.3(DI)
NetD74_3: D74.3(DI) D193.1(DO)
NetD75_1: D75.1(DO) D105.3(DI)
NetD75_3: D75.3(DI) D194.1(DO)
NetD76_1: D76.1(DO) D106.3(DI)
NetD76_3: D76.3(DI) D195.1(DO)
NetD77_1: D77.1(DO) D107.3(DI)
NetD77_3: D77.3(DI) D196.1(DO)
NetD78_1: D78.1(DO) D108.3(DI)
NetD78_3: D78.3(DI) D197.1(DO)
NetD79_1: D79.1(DO) D109.3(DI)
NetD79_3: D79.3(DI) D198.1(DO)
NetD80_1: D80.1(DO) D110.3(DI)
NetD80_3: D80.3(DI) D199.1(DO)
NetD81_1: D81.1(DO) D111.3(DI)
NetD81_3: D81.3(DI) D200.1(DO)
NetD82_1: D82.1(DO) D112.3(DI)
NetD82_3: D82.3(DI) D201.1(DO)
NetD83_1: D83.1(DO) D113.3(DI)
NetD83_3: D83.3(DI) D202.1(DO)
NetD84_1: D84.1(DO) D114.3(DI)
NetD84_3: D84.3(DI) D203.1(DO)
NetD85_1: D85.1(DO) D115.3(DI)
NetD85_3: D85.3(DI) D204.1(DO)
NetD86_1: D86.1(DO) D116.3(DI)
NetD86_3: D86.3(DI) D205.1(DO)
NetD87_1: D87.1(DO) D117.3(DI)
NetD87_3: D87.3(DI) D206.1(DO)
NetD88_1: D88.1(DO) D118.3(DI)
NetD88_3: D88.3(DI) D207.1(DO)
NetD89_1: D89.1(DO) D119.3(DI)
NetD89_3: D89.3(DI) D208.1(DO)
NetD90_1: D90.1(DO) D120.3(DI)
NetD91_1: D91.1(DO) D121.3(DI)
NetD92_1: D92.1(DO) D122.3(DI)
NetD93_1: D93.1(DO) D123.3(DI)
NetD94_1: D94.1(DO) D124.3(DI)
NetD95_1: D95.1(DO) D125.3(DI)
NetD96_1: D96.1(DO) D126.3(DI)
NetD97_1: D97.1(DO) D127.3(DI)
NetD98_1: D98.1(DO) D128.3(DI)
NetD99_1: D99.1(DO) D129.3(DI)
NetD100_1: D100.1(DO) D130.3(DI)
NetD101_1: D101.1(DO) D131.3(DI)
NetD102_1: D102.1(DO) D132.3(DI)
NetD103_1: D103.1(DO) D133.3(DI)
NetD104_1: D104.1(DO) D134.3(DI)
NetD105_1: D105.1(DO) D135.3(DI)
NetD106_1: D106.1(DO) D136.3(DI)
NetD107_1: D107.1(DO) D137.3(DI)
NetD108_1: D108.1(DO) D138.3(DI)
NetD109_1: D109.1(DO) D139.3(DI)
NetD110_1: D110.1(DO) D140.3(DI)
NetD111_1: D111.1(DO) D141.3(DI)
NetD112_1: D112.1(DO) D142.3(DI)
NetD113_1: D113.1(DO) D143.3(DI)
NetD114_1: D114.1(DO) D144.3(DI)
NetD115_1: D115.1(DO) D145.3(DI)
NetD116_1: D116.1(DO) D146.3(DI)
NetD117_1: D117.1(DO) D147.3(DI)
NetD118_1: D118.1(DO) D148.3(DI)
NetD119_1: D119.1(DO) D149.3(DI)
NetD120_1: D120.1(DO) D150.3(DI)
NetD121_1: D121.1(DO) D151.3(DI)
NetD122_1: D122.1(DO) D152.3(DI)
NetD123_1: D123.1(DO) D153.3(DI)
NetD124_1: D124.1(DO) D154.3(DI)
NetD125_1: D125.1(DO) D155.3(DI)
NetD126_1: D126.1(DO) D156.3(DI)
NetD127_1: D127.1(DO) D157.3(DI)
NetD128_1: D128.1(DO) D158.3(DI)
NetD129_1: D129.1(DO) D159.3(DI)
NetD130_1: D130.1(DO) D160.3(DI)
NetD131_1: D131.1(DO) D161.3(DI)
NetD132_1: D132.1(DO) D162.3(DI)
NetD133_1: D133.1(DO) D163.3(DI)
NetD134_1: D134.1(DO) D164.3(DI)
NetD135_1: D135.1(DO) D165.3(DI)
NetD136_1: D136.1(DO) D166.3(DI)
NetD137_1: D137.1(DO) D167.3(DI)
NetD138_1: D138.1(DO) D168.3(DI)
NetD139_1: D139.1(DO) D169.3(DI)
NetD140_1: D140.1(DO) D170.3(DI)
NetD141_1: D141.1(DO) D171.3(DI)
NetD142_1: D142.1(DO) D172.3(DI)
NetD143_1: D143.1(DO) D173.3(DI)
NetD144_1: D144.1(DO) D174.3(DI)
NetD145_1: D145.1(DO) D175.3(DI)
NetD146_1: D146.1(DO) D176.3(DI)
NetD147_1: D147.1(DO) D177.3(DI)
NetD148_1: D148.1(DO) D178.3(DI)
NetD149_1: D149.1(DO) D179.3(DI)
NetD150_1: D150.1(DO) D180.3(DI)
NetD151_1: D151.1(DO) D181.3(DI)
NetD152_1: D152.1(DO) D182.3(DI)
NetD153_1: D153.1(DO) D183.3(DI)
NetD154_1: D154.1(DO) D184.3(DI)
NetD155_1: D155.1(DO) D185.3(DI)
NetD156_1: D156.1(DO) D186.3(DI)
NetD157_1: D157.1(DO) D187.3(DI)
NetD158_1: D158.1(DO) D188.3(DI)
NetD159_1: D159.1(DO) D189.3(DI)
NetD160_1: D160.1(DO) D190.3(DI)
NetD161_1: D161.1(DO) D191.3(DI)
NetD162_1: D162.1(DO) D192.3(DI)
NetD163_1: D163.1(DO) D193.3(DI)
NetD164_1: D164.1(DO) D194.3(DI)
NetD165_1: D165.1(DO) D195.3(DI)
NetD166_1: D166.1(DO) D196.3(DI)
NetD167_1: D167.1(DO) D197.3(DI)
NetD168_1: D168.1(DO) D198.3(DI)
NetD169_1: D169.1(DO) D199.3(DI)
NetD170_1: D170.1(DO) D200.3(DI)
NetD171_1: D171.1(DO) D201.3(DI)
NetD172_1: D172.1(DO) D202.3(DI)
NetD173_1: D173.1(DO) D203.3(DI)
NetD174_1: D174.1(DO) D204.3(DI)
NetD175_1: D175.1(DO) D205.3(DI)
NetD176_1: D176.1(DO) D206.3(DI)
NetD177_1: D177.1(DO) D207.3(DI)
NetD178_1: D178.1(DO) D208.3(DI)
NetD179_1: D179.1(DO) D209.3(DI)
NetD210_1: D210.1(DO) D240.3(DI)
NetD211_1: D211.1(DO) D241.3(DI)
NetD211_3: D211.3(DI) D330.1(DO)
NetD212_1: D212.1(DO) D242.3(DI)
NetD212_3: D212.3(DI) D331.1(DO)
NetD213_1: D213.1(DO) D243.3(DI)
NetD213_3: D213.3(DI) D332.1(DO)
NetD214_1: D214.1(DO) D244.3(DI)
NetD214_3: D214.3(DI) D333.1(DO)
NetD215_1: D215.1(DO) D245.3(DI)
NetD215_3: D215.3(DI) D334.1(DO)
NetD216_1: D216.1(DO) D246.3(DI)
NetD216_3: D216.3(DI) D335.1(DO)
NetD217_1: D217.1(DO) D247.3(DI)
NetD217_3: D217.3(DI) D336.1(DO)
NetD218_1: D218.1(DO) D248.3(DI)
NetD218_3: D218.3(DI) D337.1(DO)
NetD219_1: D219.1(DO) D249.3(DI)
NetD219_3: D219.3(DI) D338.1(DO)
NetD220_1: D220.1(DO) D250.3(DI)
NetD220_3: D220.3(DI) D339.1(DO)
NetD221_1: D221.1(DO) D251.3(DI)
NetD221_3: D221.3(DI) D340.1(DO)
NetD222_1: D222.1(DO) D252.3(DI)
NetD222_3: D222.3(DI) D341.1(DO)
NetD223_1: D223.1(DO) D253.3(DI)
NetD223_3: D223.3(DI) D342.1(DO)
NetD224_1: D224.1(DO) D254.3(DI)
NetD224_3: D224.3(DI) D343.1(DO)
NetD225_1: D225.1(DO) D255.3(DI)
NetD225_3: D225.3(DI) D344.1(DO)
NetD226_1: D226.1(DO) D256.3(DI)
NetD226_3: D226.3(DI) D345.1(DO)
NetD227_1: D227.1(DO) D257.3(DI)
NetD227_3: D227.3(DI) D346.1(DO)
NetD228_1: D228.1(DO) D258.3(DI)
NetD228_3: D228.3(DI) D347.1(DO)
NetD229_1: D229.1(DO) D259.3(DI)
NetD229_3: D229.3(DI) D348.1(DO)
NetD230_1: D230.1(DO) D260.3(DI)
NetD230_3: D230.3(DI) D349.1(DO)
NetD231_1: D231.1(DO) D261.3(DI)
NetD231_3: D231.3(DI) D350.1(DO)
NetD232_1: D232.1(DO) D262.3(DI)
NetD232_3: D232.3(DI) D351.1(DO)
NetD233_1: D233.1(DO) D263.3(DI)
NetD233_3: D233.3(DI) D352.1(DO)
NetD234_1: D234.1(DO) D264.3(DI)
NetD234_3: D234.3(DI) D353.1(DO)
NetD235_1: D235.1(DO) D265.3(DI)
NetD235_3: D235.3(DI) D354.1(DO)
NetD236_1: D236.1(DO) D266.3(DI)
NetD236_3: D236.3(DI) D355.1(DO)
NetD237_1: D237.1(DO) D267.3(DI)
NetD237_3: D237.3(DI) D356.1(DO)
NetD238_1: D238.1(DO) D268.3(DI)
NetD238_3: D238.3(DI) D357.1(DO)
NetD239_1: D239.1(DO) D269.3(DI)
NetD239_3: D239.3(DI) D358.1(DO)
NetD240_1: D240.1(DO) D270.3(DI)
NetD241_1: D241.1(DO) D271.3(DI)
NetD242_1: D242.1(DO) D272.3(DI)
NetD243_1: D243.1(DO) D273.3(DI)
NetD244_1: D244.1(DO) D274.3(DI)
NetD245_1: D245.1(DO) D275.3(DI)
NetD246_1: D246.1(DO) D276.3(DI)
NetD247_1: D247.1(DO) D277.3(DI)
NetD248_1: D248.1(DO) D278.3(DI)
NetD249_1: D249.1(DO) D279.3(DI)
NetD250_1: D250.1(DO) D280.3(DI)
NetD251_1: D251.1(DO) D281.3(DI)
NetD252_1: D252.1(DO) D282.3(DI)
NetD253_1: D253.1(DO) D283.3(DI)
NetD254_1: D254.1(DO) D284.3(DI)
NetD255_1: D255.1(DO) D285.3(DI)
NetD256_1: D256.1(DO) D286.3(DI)
NetD257_1: D257.1(DO) D287.3(DI)
NetD258_1: D258.1(DO) D288.3(DI)
NetD259_1: D259.1(DO) D289.3(DI)
NetD260_1: D260.1(DO) D290.3(DI)
NetD261_1: D261.1(DO) D291.3(DI)
NetD262_1: D262.1(DO) D292.3(DI)
NetD263_1: D263.1(DO) D293.3(DI)
NetD264_1: D264.1(DO) D294.3(DI)
NetD265_1: D265.1(DO) D295.3(DI)
NetD266_1: D266.1(DO) D296.3(DI)
NetD267_1: D267.1(DO) D297.3(DI)
NetD268_1: D268.1(DO) D298.3(DI)
NetD269_1: D269.1(DO) D299.3(DI)
NetD270_1: D270.1(DO) D300.3(DI)
NetD271_1: D271.1(DO) D301.3(DI)
NetD272_1: D272.1(DO) D302.3(DI)
NetD273_1: D273.1(DO) D303.3(DI)
NetD274_1: D274.1(DO) D304.3(DI)
NetD275_1: D275.1(DO) D305.3(DI)
NetD276_1: D276.1(DO) D306.3(DI)
NetD277_1: D277.1(DO) D307.3(DI)
NetD278_1: D278.1(DO) D308.3(DI)
NetD279_1: D279.1(DO) D309.3(DI)
NetD280_1: D280.1(DO) D310.3(DI)
NetD281_1: D281.1(DO) D311.3(DI)
NetD282_1: D282.1(DO) D312.3(DI)
NetD283_1: D283.1(DO) D313.3(DI)
NetD284_1: D284.1(DO) D314.3(DI)
NetD285_1: D285.1(DO) D315.3(DI)
NetD286_1: D286.1(DO) D316.3(DI)
NetD287_1: D287.1(DO) D317.3(DI)
NetD288_1: D288.1(DO) D318.3(DI)
NetD289_1: D289.1(DO) D319.3(DI)
NetD290_1: D290.1(DO) D320.3(DI)
NetD291_1: D291.1(DO) D321.3(DI)
NetD292_1: D292.1(DO) D322.3(DI)
NetD293_1: D293.1(DO) D323.3(DI)
NetD294_1: D294.1(DO) D324.3(DI)
NetD295_1: D295.1(DO) D325.3(DI)
NetD296_1: D296.1(DO) D326.3(DI)
NetD297_1: D297.1(DO) D327.3(DI)
NetD298_1: D298.1(DO) D328.3(DI)
NetD299_1: D299.1(DO) D329.3(DI)
NetD300_1: D300.1(DO) D330.3(DI)
NetD301_1: D301.1(DO) D331.3(DI)
NetD302_1: D302.1(DO) D332.3(DI)
NetD303_1: D303.1(DO) D333.3(DI)
NetD304_1: D304.1(DO) D334.3(DI)
NetD305_1: D305.1(DO) D335.3(DI)
NetD306_1: D306.1(DO) D336.3(DI)
NetD307_1: D307.1(DO) D337.3(DI)
NetD308_1: D308.1(DO) D338.3(DI)
NetD309_1: D309.1(DO) D339.3(DI)
NetD310_1: D310.1(DO) D340.3(DI)
NetD311_1: D311.1(DO) D341.3(DI)
NetD312_1: D312.1(DO) D342.3(DI)
NetD313_1: D313.1(DO) D343.3(DI)
NetD314_1: D314.1(DO) D344.3(DI)
NetD315_1: D315.1(DO) D345.3(DI)
NetD316_1: D316.1(DO) D346.3(DI)
NetD317_1: D317.1(DO) D347.3(DI)
NetD318_1: D318.1(DO) D348.3(DI)
NetD319_1: D319.1(DO) D349.3(DI)
NetD320_1: D320.1(DO) D350.3(DI)
NetD321_1: D321.1(DO) D351.3(DI)
NetD322_1: D322.1(DO) D352.3(DI)
NetD323_1: D323.1(DO) D353.3(DI)
NetD324_1: D324.1(DO) D354.3(DI)
NetD325_1: D325.1(DO) D355.3(DI)
NetD326_1: D326.1(DO) D356.3(DI)
NetD327_1: D327.1(DO) D357.3(DI)
NetD328_1: D328.1(DO) D358.3(DI)
NetD329_1: D329.1(DO) D359.3(DI)
NetD359_1: D359.1(DO) D360.3(DI)
NetD360_1: D360.1(DO) D361.3(DI)
NetD361_1: D361.1(DO) D362.3(DI)
NetD362_1: D362.1(DO) D363.3(DI)
NetD363_1: D363.1(DO) D364.3(DI)
NetD364_1: D364.1(DO) D389.3(DI)
NetD365_1: D365.1(DO) D366.3(DI)
NetD366_1: D366.1(DO) D367.3(DI)
NetD367_1: D367.1(DO) D368.3(DI)
NetD368_1: D368.1(DO) D369.3(DI)
NetD369_1: D369.1(DO) D394.3(DI)
NetD370_1: D370.1(DO) D371.3(DI)
NetD371_1: D371.1(DO) D372.3(DI)
NetD372_1: D372.1(DO) D373.3(DI)
NetD373_1: D373.1(DO) D374.3(DI)
NetD374_1: D374.1(DO) D399.3(DI)
NetD375_1: D375.1(DO) D376.3(DI)
NetD376_1: D376.1(DO) D377.3(DI)
NetD377_1: D377.1(DO) D378.3(DI)
NetD378_1: D378.1(DO) D379.3(DI)
NetD379_1: D379.1(DO) D404.3(DI)
NetD380_1: D380.1(DO) D381.3(DI)
NetD381_1: D381.1(DO) D382.3(DI)
NetD382_1: D382.1(DO) D383.3(DI)
NetD383_1: D383.1(DO) D384.3(DI)
NetD384_1: D384.1(DO) D409.3(DI)
NetD385_3: D385.3(DI) D386.1(DO)
NetD386_3: D386.3(DI) D387.1(DO)
NetD387_3: D387.3(DI) D388.1(DO)
NetD388_3: D388.3(DI) D389.1(DO)
NetD390_3: D390.3(DI) D391.1(DO)
NetD391_3: D391.3(DI) D392.1(DO)
NetD392_3: D392.3(DI) D393.1(DO)
NetD393_3: D393.3(DI) D394.1(DO)
NetD395_3: D395.3(DI) D396.1(DO)
NetD396_3: D396.3(DI) D397.1(DO)
NetD397_3: D397.3(DI) D398.1(DO)
NetD398_3: D398.3(DI) D399.1(DO)
NetD400_3: D400.3(DI) D401.1(DO)
NetD401_3: D401.3(DI) D402.1(DO)
NetD402_3: D402.3(DI) D403.1(DO)
NetD403_3: D403.3(DI) D404.1(DO)
NetD405_3: D405.3(DI) D406.1(DO)
NetD406_3: D406.3(DI) D407.1(DO)
NetD407_3: D407.3(DI) D408.1(DO)
NetD408_3: D408.3(DI) D409.1(DO)

Not connected (* = marked no-connect by the designer): D405 1(DO)*

### Notes on the sheet
- TOP 1
- TOP 2
- TOP 3
- TOP 4
- TOP 5
- 1
- 2
- 3
- 4
- 5
- 6
- 7
- 8
- 9
- 10
- 11
- 12
- 13
- 14
- 15
- 16
- 17
- 18
- 19
- 20
- 21
- 22
- 23
- 24
- 25
- 26
- 27
- 28
- 29
- 30
- 31
- 32
- 33
- 34
- 35
- 36
- 37
- 38
- 39
- 40
- 41
- 42
- 43
- 44
- 45
- 46
- 47
- 48
- 49
- 50
- 51
- 52
- 53
- 54
- 55
- 56
- 57
- 58
- 59
- 60
- BOTTOM 1
- BOTTOM 2
- BOTTOM3
- BOTTOM 4
- BOTTOM 5

### Library data of the parts
D10-D409 = WS2812B2020: LED; SMD; 2020; RGB; 2x2x0.84mm; 3.7Ã·5.3V; Lens: transparent; 2kHz; pin to pad: 2>3 3>4 4>2; MF: WorldSemi; SnapEDA_Link: https://www.snapeda.com/parts/WS2812B2020/Worldsemi/view-part/?ref=snap; Package: None; Value: *; MP: WS2812B2020; Check_prices: https://www.snapeda.com/parts/WS2812B2020/Worldsemi/view-part/?ref=eda

## Sheet 9v_BOOST_CONVERTERS.SchDoc
size A; SheetNumber: 11; SheetTotal: 14
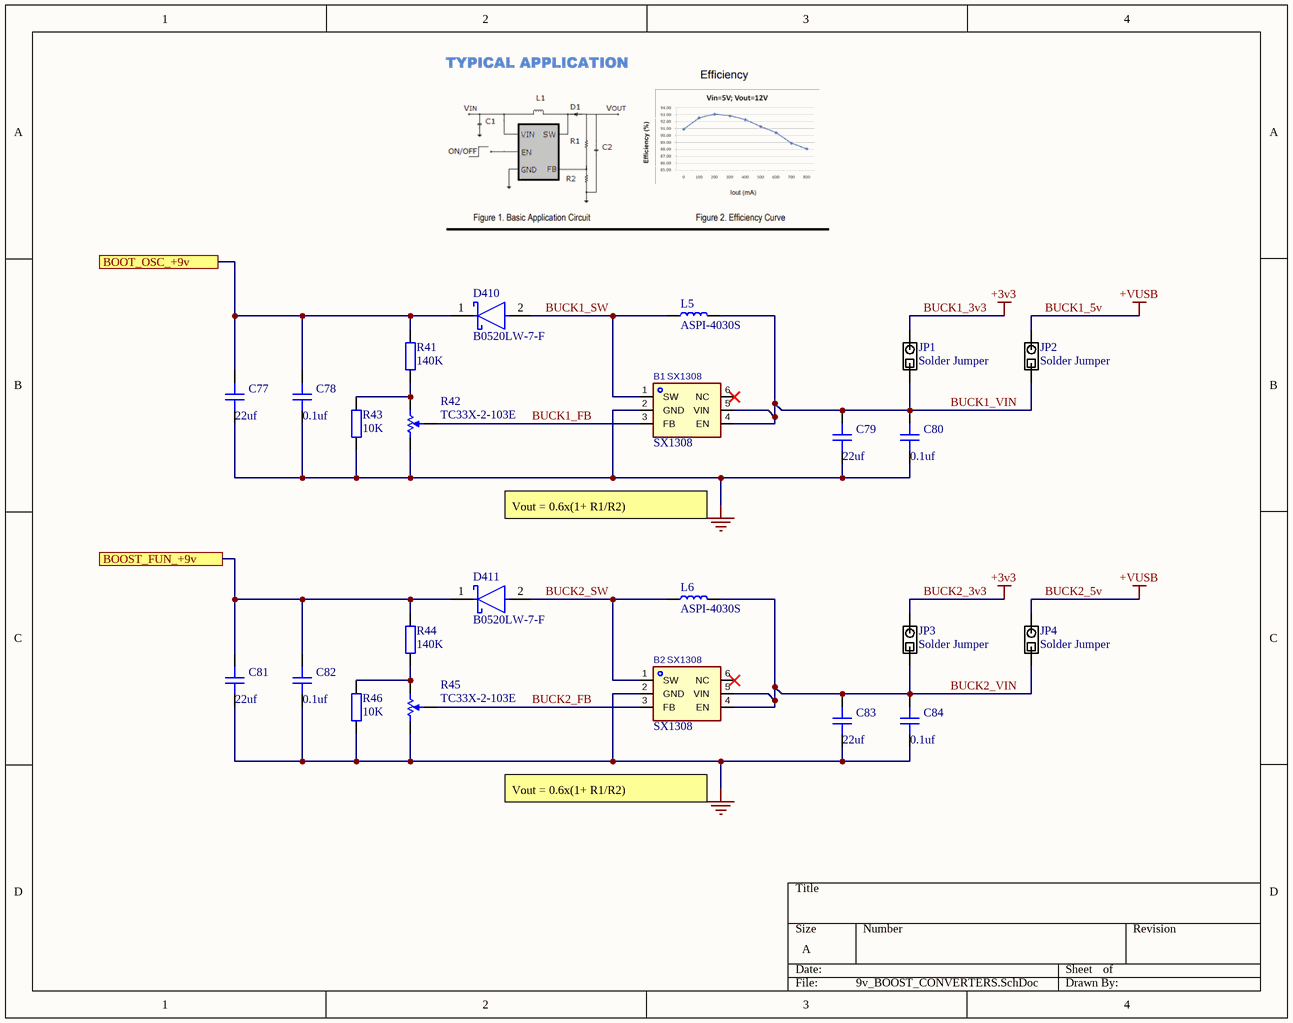
[diagram p28: 9v_BOOST_CONVERTERS.SchDoc]

### Parts
B1  SX1308  [SOT-23-6_L2.9-W1.6-P0.95-LS2.8-BL]
B2  SX1308  [SOT-23-6_L2.9-W1.6-P0.95-LS2.8-BL]
C77  22uf  [CAP_0603]
C78  0.1uf  [CAP_0603]
C79  22uf  [CAP_0603]
C80  0.1uf  [CAP_0603]
C81  22uf  [CAP_0603]
C82  0.1uf  [CAP_0603]
C83  22uf  [CAP_0603]
C84  0.1uf  [CAP_0603]
D410  B0520LW-7-F  [FP-SOD123-MFG]
D411  B0520LW-7-F  [FP-SOD123-MFG]
JP1  Solder Jumper  [SolderJumper_Single]
JP2  Solder Jumper  [SolderJumper_Single]
JP3  Solder Jumper  [SolderJumper_Single]
JP4  Solder Jumper  [SolderJumper_Single]
L5  ASPI-4030S  [ASPI-4030S]
L6  ASPI-4030S  [ASPI-4030S]
R41  140K  [RES_0603]
R42  TC33X-2-103E  [BOUR-TC33X-2_V]
R43  10K  [RES_0603]
R44  140K  [RES_0603]
R45  TC33X-2-103E  [BOUR-TC33X-2_V]
R46  10K  [RES_0603]

### Ports
BOOST_FUN_+9v, BOOT_OSC_+9v

### Nets
+FUNV: C81.2 C82.2 D411.1(C) R44.2 ; port BOOST_FUN_+9v
+OSCV: C77.2 C78.2 D410.1(C) R41.2 ; port BOOT_OSC_+9v
+VUSB: JP2.2 JP4.2  [also labelled BUCK1_5v, BUCK2_5v]  [project net ANALOG_5V]
BUCK1_3v3: JP1.2 JP3.2  [also labelled +3v3, BUCK2_3v3]
GND: B1.2(GND) B2.2(GND) C77.1 C78.1 C79.1 C80.1 C81.1 C82.1 C83.1 C84.1 R42.1 R43.1 R45.1 R46.1  [project net REF]
BUCK1_FB: B1.3(FB) R42.2  [project net BUCK1_FB_11]
BUCK1_SW: B1.1(SW) D410.2(A) L5.1  [project net BUCK1_SW_11]
BUCK1_VIN: B1.4(EN) B1.5(VIN) C79.2 C80.2 JP1.1 JP2.1 L5.2  [project net BUCK1_VIN_11]
BUCK2_FB: B2.3(FB) R45.2  [project net BUCK2_FB_11]
BUCK2_SW: B2.1(SW) D411.2(A) L6.1  [project net BUCK2_SW_11]
BUCK2_VIN: B2.4(EN) B2.5(VIN) C83.2 C84.2 JP3.1 JP4.1 L6.2  [project net BUCK2_VIN_11]
NetR41_1: R41.1 R42.3 R43.2
NetR44_1: R44.1 R45.3 R46.2

Not connected (* = marked no-connect by the designer): B1 6(NC)*; B2 6(NC)*

### Notes on the sheet
- Vout = 0.6x(1+ R1/R2)

### Library data of the parts
C77-C84 = CAP_0603: Capacitor SMD 0603; Manufacturer: *; Manufacturer Part Number: *; Distributor Link: *; LCSC: *; Rating: *; Dielectric: *
D410 D411 = CMP-12790-000026-1: DIODE SCHOTTKY 20V 500MA SOD123; Manufacturer: Diodes Inc.; Max Junction Temp: +125°C; Value: 170pF; Max Surge Forward Current: 5.5A; Forward Current: 0.5A; Standoff Height: 0mm; Peak Reverse Current: 250uA; Octopart: https://octopart.com/b0520lw-7-f-diodes+inc.-325707; Mouser Description: Schottky Diodes & Rectifiers 20V 410mW; ComponentLink2Description: Datasheet; Ipc Land Pattern Name: SOD365155X123-2; Device Class L1: Discrete Semiconductors; Category: Diode; ComponentLink2URL: https://www.diodes.com/assets/Datasheets/ds30051.pdf; Footprint Url: https://www.diodes.com/assets/Package-Files/SOD123.pdf; Package: SOD123; Device Class L3: Schottky Diodes; Digikey Description: DIODE SCHOTTKY 20V 500MA SOD123; Temperature Range Low: -65°C; RoHS: TRUE; Max Repetitive Reverse Voltage: 20V; Lead Free: Yes; Temperature: -65°C to +125°C; Reverse Voltage: 20V; Temperature Range High: +125°C; Capacitance: 170pF; Device Class L2: Diodes; Automotive: No; Height: 1.45mm; Manufacturer Part Number: B0520LW-7-F
JP1-JP4 = SolderJumper_Single: Solder Jumper Single 0.5mm Pitch
L5 L6 = ASPI-4030S: Power Inductor SMD ASPI-4030S Series; Manufacturer: ABRACON; Manufacturer Part Number: ASPI-4030S*; Distirbutor Link: *
R41 R43 R44 R46 = RES_0603: Resistor SMD 0603; Manufacturer: *; Manufacturer Part Number: *; Distributor Link: *; LCSC: *
R42 R45 = CMP-2100-03695-1: Trimming Potentiometer, 10000 Ohm, -40 to 100 degC, 3-Pin SMD, RoHS, Tape and Reel; Manufacturer: Bourns; Tolerance: 25%; Max Power Dissipation: 100mW; Number of Turns: 1; Resistance: 10KOhm; Temperature Coefficient: 250ppm/degreesC; Voltage Rating (DC): 50V; Datasheet URL: http://www.bourns.com/docs/Product-Datasheets/TC33.pdf; Composition: Potentiometer; Package Description: 3-Pin Surface Mount Device, Body 3.8 x 3.6 mm; Weight: 29.4mg; Power Rating: 100mW; Termination: FootPrint; Manufacturer URL: http://www.bourns.com/; Width: 0.118inch; Height: 0.047inch; Military Standard: Not; Radiation Hardening: No; Colour: Silver; Case/Package: SMD/SMT; Depth: 3.8mm; Min Operating Temperature: -40degC; Lead Free: LeadFree; Datasheet Version: 42583.0; REACH SVHC: NoSVHC; Length: 3mm; RoHSCompliant: true; Contact Plating: Silver; Taper: Linear; Packaging: TapeandReel; Mount: SurfaceMount; Max Operating Temperature: 100degC; Package Reference: TC33X-2; Package Quantity: 2500
B1 B2 = SX1308: Footprint: easyeda2kicad:SOT-23-6_L2.9-W1.6-P0.95-LS2.8-BL; Datasheet: https://lcsc.com/product-detail/DC-DC-Converters_SX1308_C78162.html; LCSC Part: C78162; Value: SX1308

## Sheet NANO_HEADER.SchDoc
size A; SheetNumber: 10; SheetTotal: 14
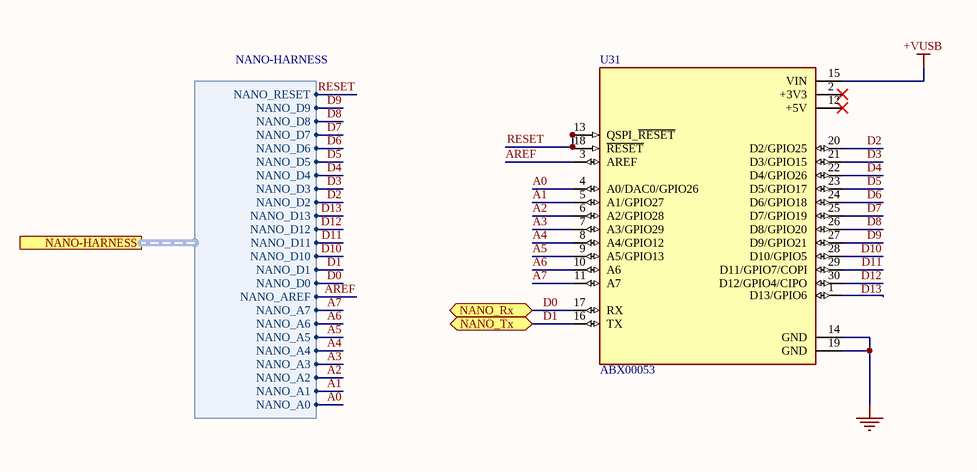
[diagram p29: NANO_HEADER.SchDoc]

### Parts
U31  ABX00053  [MODULE_ABX00053]

### Ports
NANO-HARNESS (harness NANO-HARNESS), NANO_Rx (bidir), NANO_Tx (bidir)

### Harnesses
NANO-HARNESS: NANO_A0, NANO_A1, NANO_A2, NANO_A3, NANO_A4, NANO_A5, NANO_A6, NANO_A7, NANO_AREF, NANO_D0, NANO_D1, NANO_D10, NANO_D11, NANO_D12, NANO_D13, NANO_D2, NANO_D3, NANO_D4, NANO_D5, NANO_D6, NANO_D7, NANO_D8, NANO_D9, NANO_RESET

### Nets
+VUSB: U31.15(VIN)  [project net ANALOG_5V]
GND: U31.14(GND) U31.19(GND)  [project net REF]
A0: U31.4(A0/DAC0/GPIO26) ; port NANO-HARNESS.NANO_A0
A1: U31.5(A1/GPIO27) ; port NANO-HARNESS.NANO_A1
A2: U31.6(A2/GPIO28) ; port NANO-HARNESS.NANO_A2
A3: U31.7(A3/GPIO29) ; port NANO-HARNESS.NANO_A3
A4: U31.8(A4/GPIO12) ; port NANO-HARNESS.NANO_A4
A5: U31.9(A5/GPIO13) ; port NANO-HARNESS.NANO_A5
A6: U31.10(A6) ; port NANO-HARNESS.NANO_A6
A7: U31.11(A7) ; port NANO-HARNESS.NANO_A7
AREF: U31.3(AREF) ; port NANO-HARNESS.NANO_AREF
D0: U31.17(RX) ; port NANO_Rx, port NANO-HARNESS.NANO_D0
D1: U31.16(TX) ; port NANO_Tx, port NANO-HARNESS.NANO_D1
D2: U31.20(D2/GPIO25) ; port NANO-HARNESS.NANO_D2
D3: U31.21(D3/GPIO15) ; port NANO-HARNESS.NANO_D3
D4: U31.22(D4/GPIO26) ; port NANO-HARNESS.NANO_D4
D5: U31.23(D5/GPIO17) ; port NANO-HARNESS.NANO_D5
D6: U31.24(D6/GPIO18) ; port NANO-HARNESS.NANO_D6
D7: U31.25(D7/GPIO19) ; port NANO-HARNESS.NANO_D7
D8: U31.26(D8/GPIO20) ; port NANO-HARNESS.NANO_D8
D9: U31.27(D9/GPIO21) ; port NANO-HARNESS.NANO_D9
D10: U31.28(D10/GPIO5) ; port NANO-HARNESS.NANO_D10
D11: U31.29(D11/GPIO7/COPI) ; port NANO-HARNESS.NANO_D11
D12: U31.30(D12/GPIO4/CIPO) ; port NANO-HARNESS.NANO_D12
D13: U31.1(D13/GPIO6) ; port NANO-HARNESS.NANO_D13
RESET: U31.13(QSPI_~{RESET}) U31.18(~{RESET}) ; port NANO-HARNESS.NANO_RESET  [project net \]

Not connected (* = marked no-connect by the designer): U31 2(+3V3)* 12(+5V)*

### Library data of the parts
U31 = ABX00053: NINA-W102, RP2040 Arduino Nano RP2040 Connect with Headers series ARMÂ® CortexÂ®-M0+ MCU 32-Bit Embedded Evaluation Board; Value: *; SnapEDA_Link: https://www.snapeda.com/parts/ABX00053/Arduino/view-part/?ref=snap; MF: Arduino; Purchase-URL: https://pricing.snapeda.com/search/part/ABX00053/?ref=eda; Check_prices: https://www.snapeda.com/parts/ABX00053/Arduino/view-part/?ref=eda; Digi-Key_Part_Number: 1050-ABX00053-ND; Package: None; MP: ABX00053